# Altium project PowerBoard.PrjPcb (part 1 of 2)
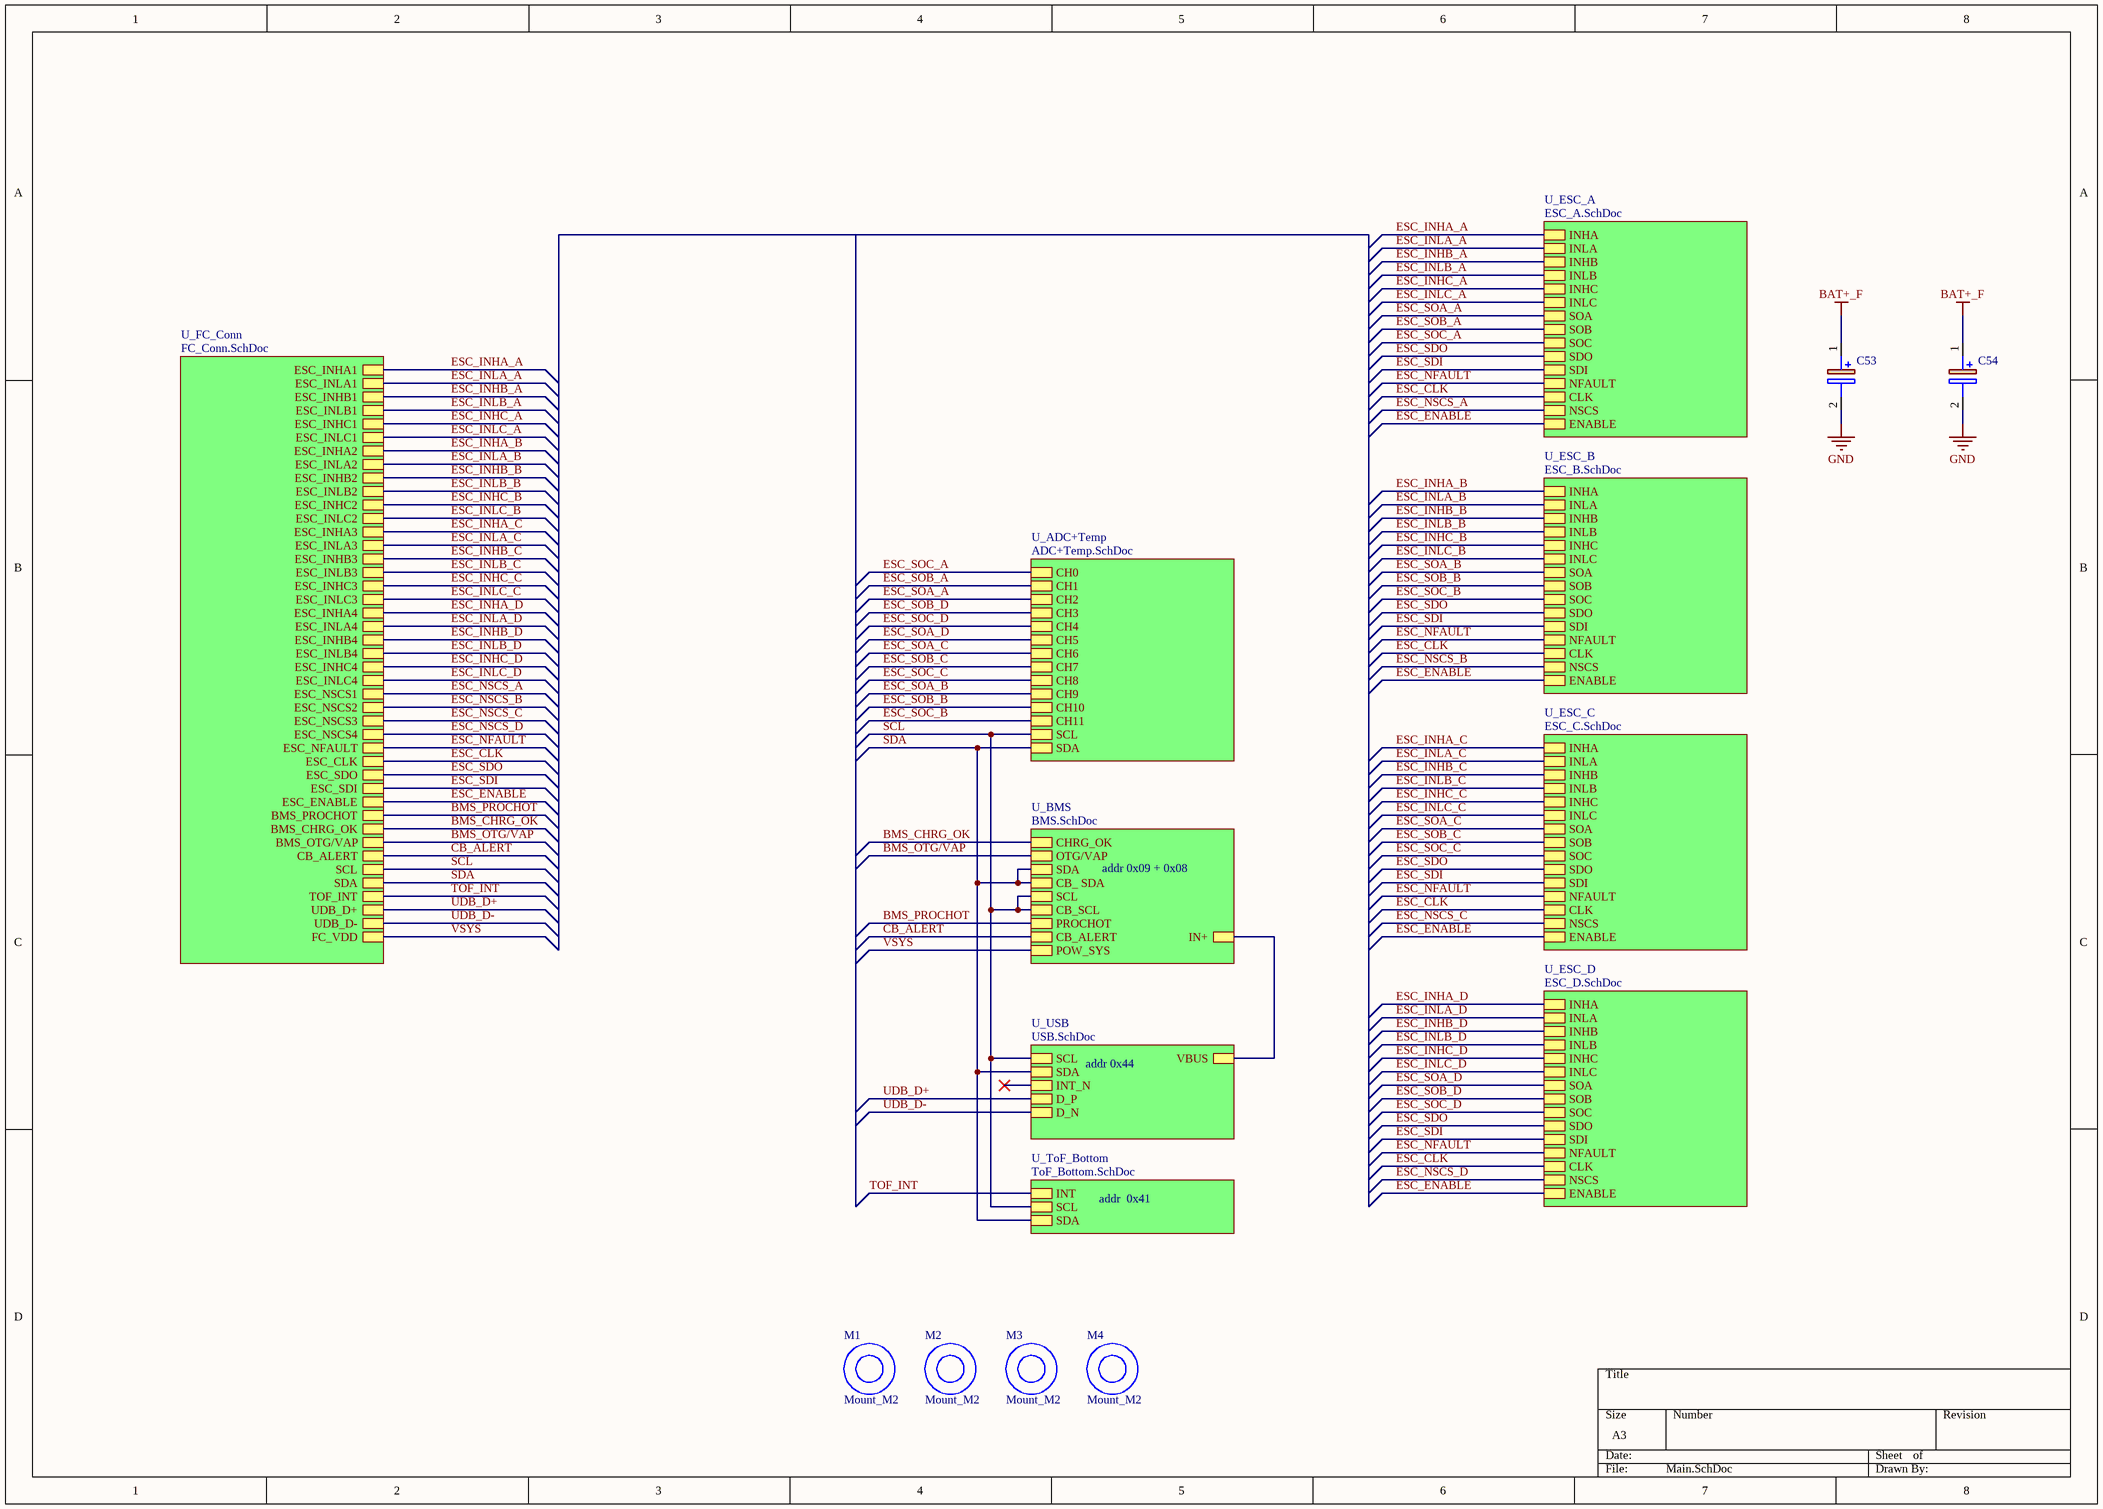
[diagram p0: Main.SchDoc]
10 sheets, 330 parts. Net scope: hierarchical (ports join the sheet entries above them; power ports are global).
Board file: PCB.PcbDoc
Sheets:
  Main.SchDoc
    U_BMS = BMS.SchDoc
    U_USB = USB.SchDoc
    U_ADC+Temp = ADC+Temp.SchDoc
    U_ToF_Bottom = ToF_Bottom.SchDoc
    U_FC_Conn = FC_Conn.SchDoc
    U_ESC_A = ESC_A.SchDoc
    U_ESC_B = ESC_B.SchDoc
    U_ESC_C = ESC_C.SchDoc
    U_ESC_D = ESC_D.SchDoc

## Sheet Main.SchDoc
size A3; SheetNumber: 1; SheetTotal: 10

### Parts
C53  EEH-ZL1V151XP  [EEEHP1H4R7P]  (value not drawn)
C54  EEH-ZL1V151XP  [EEEHP1H4R7P]  (value not drawn)
M1  Mount_M2  [Mount_M2]
M2  Mount_M2  [Mount_M2]
M3  Mount_M2  [Mount_M2]
M4  Mount_M2  [Mount_M2]

### Sub-sheets
U_ADC+Temp = ADC+Temp.SchDoc: SDA, SCL, CH0, CH1, CH2, CH3, CH4, CH5, CH6, CH7, CH8, CH9, CH10, CH11
U_BMS = BMS.SchDoc: CHRG_OK, OTG/VAP, SDA, SCL, PROCHOT, CB_SCL, CB_ SDA, CB_ALERT, POW_SYS, IN+
U_ESC_A = ESC_A.SchDoc: INHA, INLA, INHB, INLB, INHC, INLC, SOA, SOB, SOC, SDO, SDI, NFAULT, CLK, NSCS, ENABLE
U_ESC_B = ESC_B.SchDoc: INHA, INLA, INHB, INLB, INHC, INLC, SOA, SOB, SOC, SDO, SDI, NFAULT, CLK, NSCS, ENABLE
U_ESC_C = ESC_C.SchDoc: INHA, INLA, INHB, INLB, INHC, INLC, SOA, SOB, SOC, SDO, SDI, NFAULT, CLK, NSCS, ENABLE
U_ESC_D = ESC_D.SchDoc: INHA, INLA, INHB, INLB, INHC, INLC, SOA, SOB, SOC, SDO, SDI, NFAULT, CLK, NSCS, ENABLE
U_FC_Conn = FC_Conn.SchDoc: ESC_INLA1, ESC_INLB1, ESC_INLC1, ESC_INLA2, ESC_INLB2, ESC_INLC2, ESC_INLA3, ESC_INLB3, ESC_INLC3, ESC_INHA4, ESC_INLB4, ESC_INLC4, ESC_NSCS1, ESC_INHA1, ESC_INHB1, ESC_INHC1, ESC_INHA2, ESC_INHB2, ESC_INHC2, ESC_INHA3, ESC_INHB3, ESC_INHC3, ESC_INLA4, ESC_INHB4, ESC_INHC4, ESC_NSCS2, ESC_NSCS3, ESC_NSCS4, ESC_NFAULT, ESC_CLK, ESC_SDO, ESC_SDI, ESC_ENABLE, BMS_PROCHOT, BMS_CHRG_OK, BMS_OTG/VAP, CB_ALERT, SCL, SDA, TOF_INT, UDB_D+, UDB_D-, FC_VDD
U_ToF_Bottom = ToF_Bottom.SchDoc: INT, SCL, SDA
U_USB = USB.SchDoc: SCL, SDA, INT_N, D_P, D_N, VBUS

### Nets
BAT+_F: C53.1(+) C54.1(+)
GND: C53.2(-) C54.2(-)
BMS_CHRG_OK: sheet U_BMS/CHRG_OK, sheet U_FC_Conn/BMS_CHRG_OK
BMS_OTG/VAP: sheet U_BMS/OTG/VAP, sheet U_FC_Conn/BMS_OTG/VAP
BMS_PROCHOT: sheet U_BMS/PROCHOT, sheet U_FC_Conn/BMS_PROCHOT
CB_ALERT: sheet U_BMS/CB_ALERT, sheet U_FC_Conn/CB_ALERT
ESC_CLK: sheet U_FC_Conn/ESC_CLK, sheet U_ESC_A/CLK, sheet U_ESC_B/CLK, sheet U_ESC_C/CLK, sheet U_ESC_D/CLK
ESC_ENABLE: sheet U_FC_Conn/ESC_ENABLE, sheet U_ESC_A/ENABLE, sheet U_ESC_B/ENABLE, sheet U_ESC_C/ENABLE, sheet U_ESC_D/ENABLE
ESC_INHA_A: sheet U_FC_Conn/ESC_INHA1, sheet U_ESC_A/INHA
ESC_INHA_B: sheet U_FC_Conn/ESC_INHA2, sheet U_ESC_B/INHA
ESC_INHA_C: sheet U_FC_Conn/ESC_INHA3, sheet U_ESC_C/INHA
ESC_INHA_D: sheet U_FC_Conn/ESC_INHA4, sheet U_ESC_D/INHA
ESC_INHB_A: sheet U_FC_Conn/ESC_INHB1, sheet U_ESC_A/INHB
ESC_INHB_B: sheet U_FC_Conn/ESC_INHB2, sheet U_ESC_B/INHB
ESC_INHB_C: sheet U_FC_Conn/ESC_INHB3, sheet U_ESC_C/INHB
ESC_INHB_D: sheet U_FC_Conn/ESC_INHB4, sheet U_ESC_D/INHB
ESC_INHC_A: sheet U_FC_Conn/ESC_INHC1, sheet U_ESC_A/INHC
ESC_INHC_B: sheet U_FC_Conn/ESC_INHC2, sheet U_ESC_B/INHC
ESC_INHC_C: sheet U_FC_Conn/ESC_INHC3, sheet U_ESC_C/INHC
ESC_INHC_D: sheet U_FC_Conn/ESC_INHC4, sheet U_ESC_D/INHC
ESC_INLA_A: sheet U_FC_Conn/ESC_INLA1, sheet U_ESC_A/INLA
ESC_INLA_B: sheet U_FC_Conn/ESC_INLA2, sheet U_ESC_B/INLA
ESC_INLA_C: sheet U_FC_Conn/ESC_INLA3, sheet U_ESC_C/INLA
ESC_INLA_D: sheet U_FC_Conn/ESC_INLA4, sheet U_ESC_D/INLA
ESC_INLB_A: sheet U_FC_Conn/ESC_INLB1, sheet U_ESC_A/INLB
ESC_INLB_B: sheet U_FC_Conn/ESC_INLB2, sheet U_ESC_B/INLB
ESC_INLB_C: sheet U_FC_Conn/ESC_INLB3, sheet U_ESC_C/INLB
ESC_INLB_D: sheet U_FC_Conn/ESC_INLB4, sheet U_ESC_D/INLB
ESC_INLC_A: sheet U_FC_Conn/ESC_INLC1, sheet U_ESC_A/INLC
ESC_INLC_B: sheet U_FC_Conn/ESC_INLC2, sheet U_ESC_B/INLC
ESC_INLC_C: sheet U_FC_Conn/ESC_INLC3, sheet U_ESC_C/INLC
ESC_INLC_D: sheet U_FC_Conn/ESC_INLC4, sheet U_ESC_D/INLC
ESC_NFAULT: sheet U_FC_Conn/ESC_NFAULT, sheet U_ESC_A/NFAULT, sheet U_ESC_B/NFAULT, sheet U_ESC_C/NFAULT, sheet U_ESC_D/NFAULT
ESC_NSCS_A: sheet U_FC_Conn/ESC_NSCS1, sheet U_ESC_A/NSCS
ESC_NSCS_B: sheet U_FC_Conn/ESC_NSCS2, sheet U_ESC_B/NSCS
ESC_NSCS_C: sheet U_FC_Conn/ESC_NSCS3, sheet U_ESC_C/NSCS
ESC_NSCS_D: sheet U_FC_Conn/ESC_NSCS4, sheet U_ESC_D/NSCS
ESC_SDI: sheet U_FC_Conn/ESC_SDI, sheet U_ESC_A/SDI, sheet U_ESC_B/SDI, sheet U_ESC_C/SDI, sheet U_ESC_D/SDI
ESC_SDO: sheet U_FC_Conn/ESC_SDO, sheet U_ESC_A/SDO, sheet U_ESC_B/SDO, sheet U_ESC_C/SDO, sheet U_ESC_D/SDO
ESC_SOA_A: sheet U_ADC+Temp/CH2, sheet U_ESC_A/SOA
ESC_SOA_B: sheet U_ADC+Temp/CH9, sheet U_ESC_B/SOA
ESC_SOA_C: sheet U_ADC+Temp/CH6, sheet U_ESC_C/SOA
ESC_SOA_D: sheet U_ADC+Temp/CH5, sheet U_ESC_D/SOA
ESC_SOB_A: sheet U_ADC+Temp/CH1, sheet U_ESC_A/SOB
ESC_SOB_B: sheet U_ADC+Temp/CH10, sheet U_ESC_B/SOB
ESC_SOB_C: sheet U_ADC+Temp/CH7, sheet U_ESC_C/SOB
ESC_SOB_D: sheet U_ADC+Temp/CH3, sheet U_ESC_D/SOB
ESC_SOC_A: sheet U_ADC+Temp/CH0, sheet U_ESC_A/SOC
ESC_SOC_B: sheet U_ADC+Temp/CH11, sheet U_ESC_B/SOC
ESC_SOC_C: sheet U_ADC+Temp/CH8, sheet U_ESC_C/SOC
ESC_SOC_D: sheet U_ADC+Temp/CH4, sheet U_ESC_D/SOC
SCL: sheet U_BMS/SCL, sheet U_BMS/CB_SCL, sheet U_USB/SCL, sheet U_ADC+Temp/SCL, sheet U_ToF_Bottom/SCL, sheet U_FC_Conn/SCL
SDA: sheet U_BMS/SDA, sheet U_BMS/CB_ SDA, sheet U_USB/SDA, sheet U_ADC+Temp/SDA, sheet U_ToF_Bottom/SDA, sheet U_FC_Conn/SDA
TOF_INT: sheet U_ToF_Bottom/INT, sheet U_FC_Conn/TOF_INT
UDB_D+: sheet U_USB/D_P, sheet U_FC_Conn/UDB_D+  [project net D_P]
UDB_D-: sheet U_USB/D_N, sheet U_FC_Conn/UDB_D-  [project net D_N]
VBUS: sheet U_BMS/IN+, sheet U_USB/VBUS
VSYS: sheet U_BMS/POW_SYS, sheet U_FC_Conn/FC_VDD

### Notes on the sheet
- addr 0x09 + 0x08
- addr 0x44
- addr  0x41

### Library data of the parts
C53 C54 = EEH-ZL1V151XP: Capacitor Polarised; Manufacturer_Name: Panasonic; Datasheet Link: https://industrial.panasonic.com/cdbs/www-data/pdf/RDD0000/ast-ind-303928.pdf; Manufacturer_Part_Number: EEH-ZL1V151XP

## Sheet BMS.SchDoc
size A2; SheetNumber: 3; SheetTotal: 10
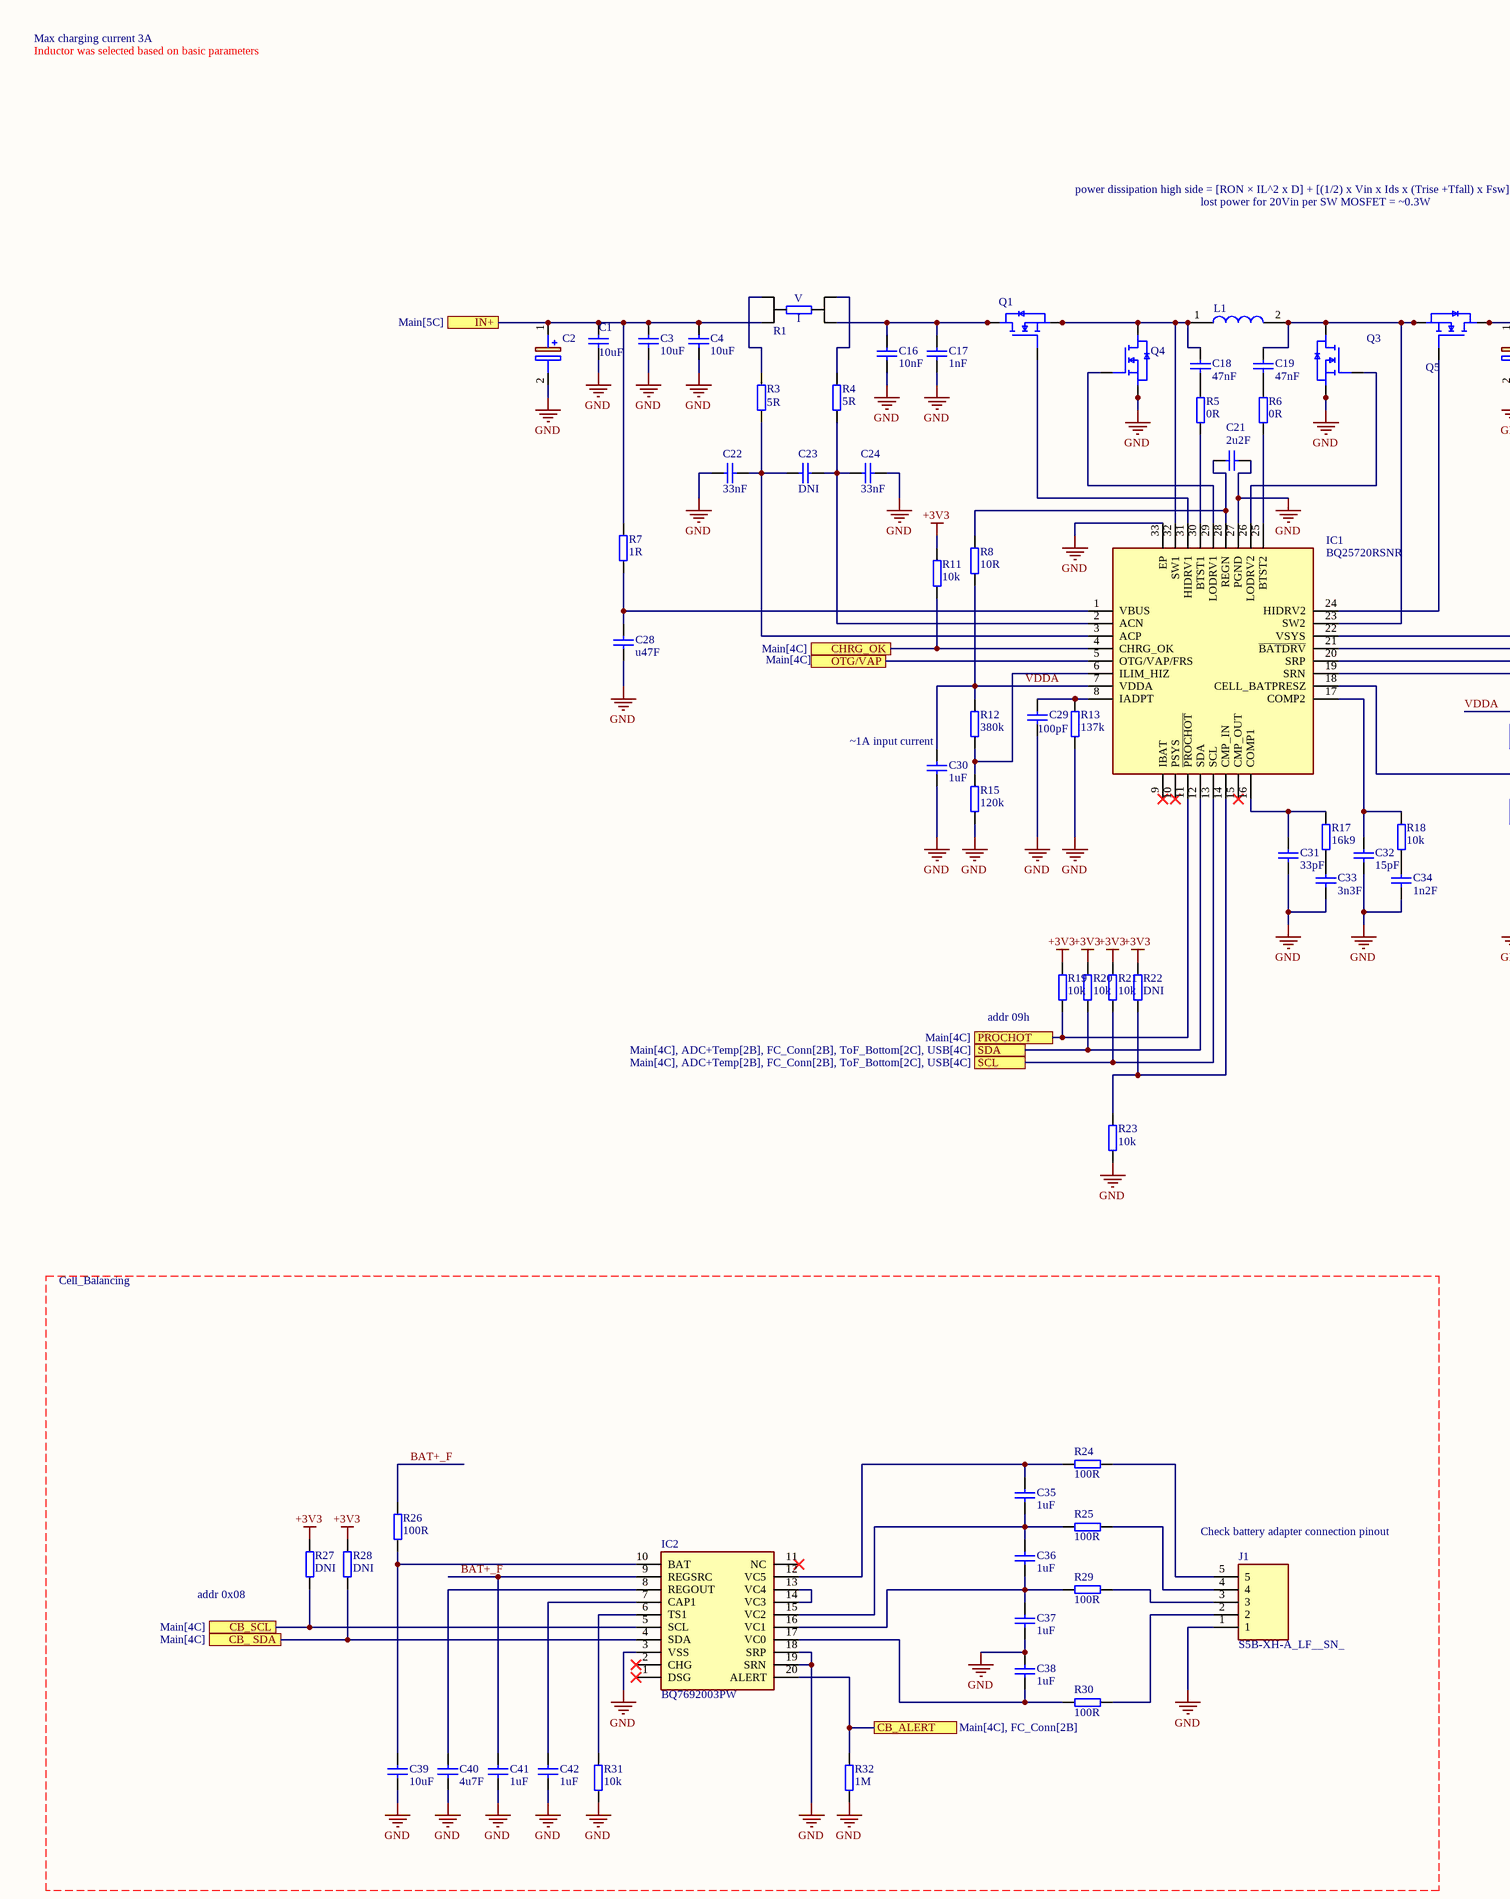
[diagram p1: BMS.SchDoc, left]
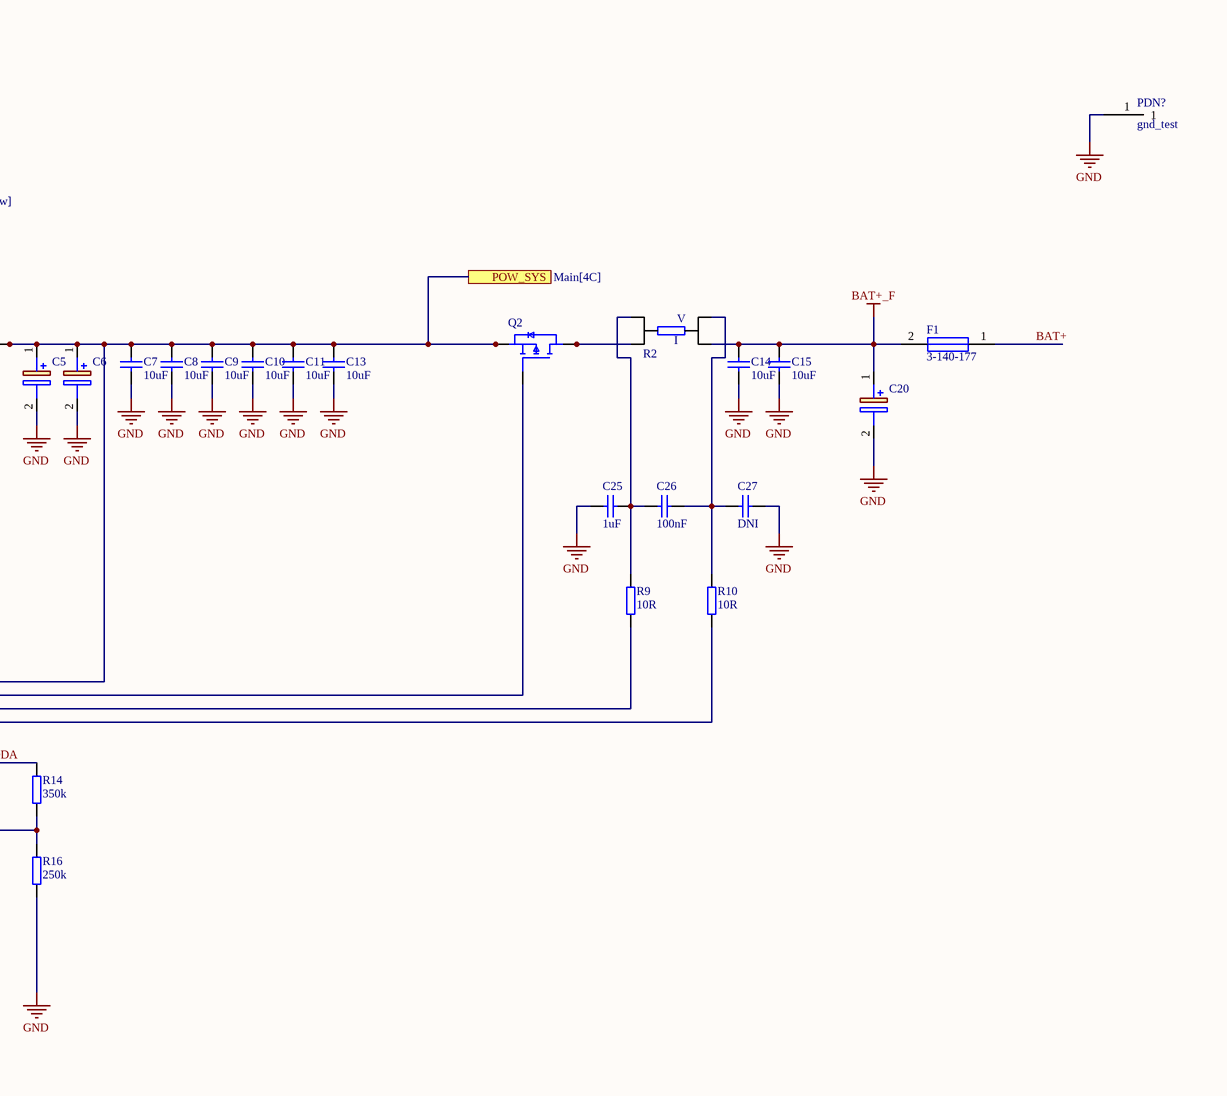
[diagram p2: BMS.SchDoc, right]

### Parts
C1  value 10uF  [CAP0603]  (hidden comment: Cap0603)
C2  TR3D336K025D0200  [CAPPM7343X310N]  (value not drawn)
C3  value 10uF  [CAP0805]  (hidden comment: Cap0805)
C4  value 10uF  [CAP0805]  (hidden comment: Cap0805)
C5  293D226X0025D2TE3  [CAPPM7343X310N]  (value not drawn)
C6  293D226X0025D2TE3  [CAPPM7343X310N]  (value not drawn)
C7  value 10uF  [CAP0805]  (hidden comment: Cap0805)
C8  value 10uF  [CAP0805]  (hidden comment: Cap0805)
C9  value 10uF  [CAP0805]  (hidden comment: Cap0805)
C10  value 10uF  [CAP0805]  (hidden comment: Cap0805)
C11  value 10uF  [CAP0805]  (hidden comment: Cap0805)
C13  value 10uF  [CAP0805]  (hidden comment: Cap0805)
C14  value 10uF  [CAP0805]  (hidden comment: Cap0805)
C15  value 10uF  [CAP0805]  (hidden comment: Cap0805)
C16  value 10nF  [CAP0402]  (hidden comment: Cap0402)
C17  value 1nF  [CAP0402]  (hidden comment: Cap0402)
C18  value 47nF  [CAP0402]  (hidden comment: Cap0402)
C19  value 47nF  [CAP0402]  (hidden comment: Cap0402)
C20  EEH-ZL1V151XP  [EEEHP1H4R7P]  (value not drawn)
C21  value 2u2F  [CAP0402]  (hidden comment: Cap0402)
C22  value 33nF  [CAP0402]  (hidden comment: Cap0402)
C23  value DNI  [CAP0402]  (hidden comment: Cap0402)
C24  value 33nF  [CAP0402]  (hidden comment: Cap0402)
C25  value 1uF  [CAP0402]  (hidden comment: Cap0402)
C26  value 100nF  [CAP0402]  (hidden comment: Cap0402)
C27  value DNI  [CAP0402]  (hidden comment: Cap0402)
C28  value u47F  [CAP0603]  (hidden comment: Cap0603)
C29  value 100pF  [CAP0402]  (hidden comment: Cap0402)
C30  value 1uF  [CAP0402]  (hidden comment: Cap0402)
C31  value 33pF  [CAP0402]  (hidden comment: Cap0402)
C32  value 15pF  [CAP0402]  (hidden comment: Cap0402)
C33  value 3n3F  [CAP0402]  (hidden comment: Cap0402)
C34  value 1n2F  [CAP0402]  (hidden comment: Cap0402)
C35  value 1uF  [CAP0402]  (hidden comment: Cap0402)
C36  value 1uF  [CAP0402]  (hidden comment: Cap0402)
C37  value 1uF  [CAP0402]  (hidden comment: Cap0402)
C38  value 1uF  [CAP0402]  (hidden comment: Cap0402)
C39  value 10uF  [CAP0805]  (hidden comment: Cap0805)
C40  value 4u7F  [CAP0805]  (hidden comment: Cap0402)
C41  value 1uF  [CAP0402]  (hidden comment: Cap0402)
C42  value 1uF  [CAP0402]  (hidden comment: Cap0402)
F1  3-140-177  [3140177]
IC1  BQ25720RSNR  [QFN40P400X400X80-33N-D]
IC2  BQ7692003PW  [SOP65P640X120-20N]
J1  S5B-XH-A_LF__SN_  [SHDRRA5W64P0X250_1X5_1490X1150X610P]
L1  XEL4020-222MEC  [XEL4020222MEC]  (value not drawn)
PDN?  gnd_test  [GND_test]
Q1  PMPB07R3ENAX  [DMT3006LFDF7]  (value not drawn)
Q2  SISA01DN-T1-GE3  [SIS862DNT1GE3]  (value not drawn)
Q3  PMPB07R3ENAX  [DMT3006LFDF7]  (value not drawn)
Q4  PMPB07R3ENAX  [DMT3006LFDF7]  (value not drawn)
Q5  PMPB07R3ENAX  [DMT3006LFDF7]  (value not drawn)
R1  L4CA0612LR010FNR  [L4CA0612L0M50FNR]  (value not drawn)
R2  L4CA0612LR010FNR  [L4CA0612L0M50FNR]  (value not drawn)
R3  value 5R  [RES0402]  (hidden comment: Res0402)
R4  value 5R  [RES0402]  (hidden comment: Res0402)
R5  value 0R  [RES0402]  (hidden comment: Res0402)
R6  value 0R  [RES0402]  (hidden comment: Res0402)
R7  value 1R  [RES0603]  (hidden comment: Res0603)
R8  value 10R  [RES0402]  (hidden comment: Res0402)
R9  value 10R  [RES0402]  (hidden comment: Res0402)
R10  value 10R  [RES0402]  (hidden comment: Res0402)
R11  value 10k  [RES0402]  (hidden comment: Res0402)
R12  value 380k  [RES0402]  (hidden comment: Res0402)
R13  value 137k  [RES0402]  (hidden comment: Res0402)
R14  value 350k  [RES0402]  (hidden comment: Res0402)
R15  value 120k  [RES0402]  (hidden comment: Res0402)
R16  value 250k  [RES0402]  (hidden comment: Res0402)
R17  value 16k9  [RES0402]  (hidden comment: Res0402)
R18  value 10k  [RES0402]  (hidden comment: Res0402)
R19  value 10k  [RES0402]  (hidden comment: Res0402)
R20  value 10k  [RES0402]  (hidden comment: Res0402)
R21  value 10k  [RES0402]  (hidden comment: Res0402)
R22  value DNI  [RES0402]  (hidden comment: Res0402)
R23  value 10k  [RES0402]  (hidden comment: Res0402)
R24  value 100R  [RES0805]  (hidden comment: Res0805)
R25  value 100R  [RES0805]  (hidden comment: Res0805)
R26  value 100R  [RES0402]  (hidden comment: Res0805)
R27  value DNI  [RES0402]  (hidden comment: Res0402)
R28  value DNI  [RES0402]  (hidden comment: Res0402)
R29  value 100R  [RES0805]  (hidden comment: Res0805)
R30  value 100R  [RES0805]  (hidden comment: Res0805)
R31  value 10k  [RES0402]  (hidden comment: Res0402)
R32  value 1M  [RES0402]  (hidden comment: Res0402)

### Ports
CB_ SDA (see Main[4C]), CB_ALERT (see Main[4C], FC_Conn[2B]), CB_SCL (see Main[4C]), CHRG_OK (see Main[4C]), IN+ (see Main[5C]), OTG/VAP (see Main[4C]), POW_SYS (see Main[4C]), PROCHOT (see Main[4C]), SCL (see Main[4C], ADC+Temp[2B], FC_Conn[2B], ToF_Bottom[2C], USB[4C]), SDA (see Main[4C], ADC+Temp[2B], FC_Conn[2B], ToF_Bottom[2C], USB[4C])

### Nets
+3V3: R11.2 R19.2 R20.2 R21.2 R22.2 R27.2 R28.2
BAT+_F: C14.2 C15.2 C20.1(+) C41.2 F1.2 IC2.9(REGSRC) R2.2 R26.2
GND: C1.1 C2.2(-) C3.1 C4.1 C5.2(-) C6.2(-) C7.1 C8.1 C9.1 C10.1 C11.1 C13.1 C14.1 C15.1 C16.1 C17.1 C20.2(-) C21.1 C22.1 C24.2 C25.1 C27.2 C28.1 C29.1 C30.1 C31.1 C32.1 C33.1 C34.1 C37.1 C38.2 C39.1 C40.1 C41.1 C42.1 IC1.27(PGND) IC1.33(EP) IC2.3(VSS) IC2.18(SRP) IC2.19(SRN) J1.1 PDN?.1 Q3.4(S_1) Q3.8(S_2) Q4.4(S_1) Q4.8(S_2) R13.1 R15.1 R16.1 R23.1 R31.1 R32.1
BAT+: F1.1
BMS_CHRG_OK: IC1.4(CHRG_OK) R11.1 ; port CHRG_OK
BMS_OTG/VAP: IC1.5(OTG/VAP/FRS) ; port OTG/VAP
BMS_PROCHOT: IC1.11(~{PROCHOT}) R19.1 ; port PROCHOT
CB_ALERT: IC2.20(ALERT) R32.2 ; port CB_ALERT
SCL: IC1.13(SCL) IC2.5(SCL) R21.1 R27.1 ; port SCL, port CB_SCL
SDA: IC1.12(SDA) IC2.4(SDA) R20.1 R28.1 ; port SDA, port CB_ SDA
VBUS: C1.2 C2.1(+) C3.2 C4.2 R1.2 R7.2 ; port IN+
VDDA: C30.2 IC1.7(VDDA) R8.2 R12.2 R14.2
VSYS: C5.1(+) C6.1(+) C7.2 C8.2 C9.2 C10.2 C11.2 C13.2 IC1.22(VSYS) Q2.1(S_1) Q2.2(S_2) Q2.3(S_3) Q5.1(D_1) Q5.2(D_2) Q5.5(D_3) Q5.6(D_4) Q5.7(D_5) ; port POW_SYS
NetC16_2: C16.2 C17.2 Q1.1(D_1) Q1.2(D_2) Q1.5(D_3) Q1.6(D_4) Q1.7(D_5) R1.3
NetC18_1: C18.1 R5.2
NetC18_2: C18.2 IC1.32(SW1) L1.1 Q1.4(S_1) Q1.8(S_2) Q4.1(D_1) Q4.2(D_2) Q4.5(D_3) Q4.6(D_4) Q4.7(D_5)
NetC19_1: C19.1 R6.2
NetC19_2: C19.2 IC1.23(SW2) L1.2 Q3.1(D_1) Q3.2(D_2) Q3.5(D_3) Q3.6(D_4) Q3.7(D_5) Q5.4(S_1) Q5.8(S_2)
NetC21_2: C21.2 IC1.28(REGN) R8.1
NetC22_2: C22.2 C23.1 IC1.3(ACP) R3.1
NetC23_2: C23.2 C24.1 IC1.2(ACN) R4.1
NetC25_2: C25.2 C26.1 R2.4 R9.2
NetC26_2: C26.2 C27.1 R2.1 R10.2
NetC28_2: C28.2 IC1.1(VBUS) R7.1
NetC29_2: C29.2 IC1.8(IADPT) R13.2
NetC31_2: C31.2 IC1.16(COMP1) R17.2
NetC32_2: C32.2 IC1.17(COMP2) R18.2
NetC33_2: C33.2 R17.1
NetC34_2: C34.2 R18.1
NetC35_1: C35.1 C36.2 IC2.15(VC2) R25.1
NetC35_2: C35.2 IC2.12(VC5) R24.1
NetC36_1: C36.1 C37.2 IC2.16(VC1) R29.1
NetC38_1: C38.1 IC2.17(VC0) R30.1
NetC39_2: C39.2 IC2.10(BAT) R26.1
NetC40_2: C40.2 IC2.8(REGOUT)
NetC42_2: C42.2 IC2.7(CAP1)
NetIC1_6: IC1.6(ILIM_HIZ) R12.1 R15.2
NetIC1_14: IC1.14(CMP_IN) R22.1 R23.2
NetIC1_18: IC1.18(CELL_BATPRESZ) R14.1 R16.2
NetIC1_19: IC1.19(SRN) R10.1
NetIC1_20: IC1.20(SRP) R9.1
NetIC1_21: IC1.21(~{BATDRV}) Q2.4(G)
NetIC1_24: IC1.24(HIDRV2) Q5.3(G)
NetIC1_25: IC1.25(BTST2) R6.1
NetIC1_26: IC1.26(LODRV2) Q3.3(G)
NetIC1_29: IC1.29(LODRV1) Q4.3(G)
NetIC1_30: IC1.30(BTST1) R5.1
NetIC1_31: IC1.31(HIDRV1) Q1.3(G)
NetIC2_6: IC2.6(TS1) R31.2
NetIC2_13: IC2.13(VC4) IC2.14(VC3)
NetJ1_2: J1.2 R30.2
NetJ1_3: J1.3 R29.2
NetJ1_4: J1.4 R25.2
NetJ1_5: J1.5 R24.2
NetQ2_5: Q2.5(D_1) Q2.6(D_2) Q2.7(D_3) Q2.8(D_4) Q2.9(D_4) R2.3
NetR1_1: R1.1 R3.2
NetR1_4: R1.4 R4.2

Not connected (* = marked no-connect by the designer): IC1 9(IBAT)* 10(PSYS)* 15(CMP_OUT)*; IC2 1(DSG)* 2(CHG)* 11(NC)*

### Notes on the sheet
- Max charging current 3A
- Inductor was selected based on basic parameters
- power dissipation high side = [RON × IL^2 x D] + [(1/2) x Vin x Ids x (Trise +Tfall) x Fsw]
- lost power for 20Vin per SW MOSFET = ~0.3W
- (near C30) ~1A input current
- (near R19) addr 09h
- Cell_Balancing
- (near J1) Check battery adapter connection pinout
- addr 0x08
- (in symbol L4CA0612LR010FNR) V; I

### Library data of the parts
C1 C28 = Cap0603: Voltage: 25V
C2 = TR3D336K025D0200: Capacitor Polarised; Manufacturer_Name: Vishay; Value: 33uF; Datasheet Link: http://www.vishay.com/doc?40080; Height: 3.1mm; Manufacturer_Part_Number: TR3D336K025D0200; Mouser Part Number: 74-TR3D336K025D0200; Mouser Price/Stock: https://www.mouser.com/Search/Refine.aspx?Keyword=74-TR3D336K025D0200
C3 C4 C7-C11 C13-C15 C39 = Cap0805: Voltage: 50V
C5 C6 = 293D226X0025D2TE3: Capacitor Polarised; Manufacturer_Name: Vishay; Value: 22uF; Datasheet Link: http://www.vishay.com/docs/40002/293d.pdf; Height: 3.1mm; Manufacturer_Part_Number: 293D226X0025D2TE3; Mouser Part Number: 74-293D226X0025D2TE3; Mouser Price/Stock: https://www.mouser.co.uk/ProductDetail/Vishay-Sprague/293D226X0025D2TE3?qs=27QRfRkF2isTHSjSebANCw%3D%3D
C16-C19 C40-C42 = Cap0402: Voltage: 50V
C20 = EEH-ZL1V151XP: as C53 on sheet Main; Datasheet Link: https://industrial.panasonic.com/cdbs/www-data/pdf/RDD0000/ast-ind-303928.pdf; Manufacturer_Part_Number: EEH-ZL1V151XP
C21 C29-C34 = Cap0402: Voltage: 25V
C22 C24-C26 C35-C38 = Cap0402: Voltage: 6V3
F1 = 3-140-177: Fuse; Manufacturer_Name: SCHURTER; Datasheet Link: https://www.schurter.com/en/datasheet/typ_UHS.pdf; Height: 4.85mm; Manufacturer_Part_Number: 3-140-177; Mouser Part Number: 693-3-140-177; Mouser Price/Stock: https://www.mouser.co.uk/ProductDetail/Schurter/3-140-177?qs=3Rah4i%252BhyCHL3c0yS6dOkg%3D%3D; Arrow Part Number: 3-140-177; Arrow Price/Stock: https://www.arrow.com/en/products/3-140-177/schurter?region=europe
IC1 = BQ25720RSNR: Integrated Circuit; Manufacturer_Name: Texas Instruments; Datasheet Link: https://www.ti.com/lit/ds/symlink/bq25720.pdf?ts=1649085131820&ref_url=https%253A%252F%252Fwww.ti.com%252Fproduct%252FBQ25720; Height: 0.8mm; Manufacturer_Part_Number: BQ25720RSNR; Mouser Part Number: 595-BQ25720RSNR; Mouser Price/Stock: https://www.mouser.co.uk/ProductDetail/Texas-Instruments/BQ25720RSNR?qs=ljCeji4nMDlwF8f%2Foae7aQ%3D%3D
IC2 = BQ7692003PW: Integrated Circuit; Manufacturer_Name: Texas Instruments; Datasheet Link: http://www.ti.com/lit/gpn/BQ76920; Height: 1.2mm; Manufacturer_Part_Number: BQ7692003PW; Mouser Part Number: 595-BQ7692003PW; Mouser Price/Stock: https://www.mouser.co.uk/ProductDetail/Texas-Instruments/BQ7692003PW?qs=%2Fd%252BFzHvH4c0Hx6X3GvdboA%3D%3D; Arrow Part Number: BQ7692003PW; Arrow Price/Stock: https://www.arrow.com/en/products/bq7692003pw/texas-instruments?utm_currency=USD&region=nac
J1 = S5B-XH-A_LF__SN_: Connector; Manufacturer_Name: JST (JAPAN SOLDERLESS TERMINALS); Manufacturer_Part_Number: S5B-XH-A(LF)(SN); Datasheet Link: http://www.jst-mfg.com/product/pdf/eng/eXH.pdf; Height: 6.1mm; Mouser Part Number: 306-S5B-XH-ALFSN; Mouser Price/Stock: https://www.mouser.co.uk/ProductDetail/JST-Commercial/S5B-XH-ALFSN?qs=QpmGXVUTftFJm7Okp%252B2lFg%3D%3D; Arrow Part Number: S5B-XH-A(LF)(SN); Arrow Price/Stock: https://www.arrow.com/en/products/s5b-xh-a-lf-sn/jst-manufacturing?utm_currency=USD&region=europe
L1 = XEL4020-222MEC: Inductor; Manufacturer_Name: COILCRAFT; Height: 2.1mm; Manufacturer_Part_Number: XEL4020-222MEC; Mouser Part Number: 994-XEL4020-222MEC; Mouser Price/Stock: https://www.mouser.co.uk/ProductDetail/Coilcraft/XEL4020-222MEC?qs=chTDxNqvsynf4rqMeCpizg%3D%3D
Q1 Q3-Q5 = DMT3006LFDF-7: MOSFET (N-Channel); Manufacturer_Name: Diodes Incorporated; Datasheet Link: https://www.arrow.com/en/products/dmt3006lfdf-7/diodes-incorporated; Height: 0.63mm; Manufacturer_Part_Number: DMT3006LFDF-7; Mouser Part Number: 621-DMT3006LFDF-7; Mouser Price/Stock: https://www.mouser.co.uk/ProductDetail/Diodes-Incorporated/DMT3006LFDF-7?qs=4EhzHfbM1GhGS5nn3gf3wg%3D%3D; Arrow Part Number: DMT3006LFDF-7; Arrow Price/Stock: https://www.arrow.com/en/products/dmt3006lfdf-7/diodes-incorporated
Q2 = SISA01DN-T1-GE3: MOSFET (P-Channel); Manufacturer_Name: Vishay; Datasheet Link: https://www.vishay.com/docs/76198/sisa01dn.pdf; Manufacturer_Part_Number: SISA01DN-T1-GE3; Mouser Part Number: 78-SISA01DN-T1-GE3; Mouser Price/Stock: https://www.mouser.co.uk/ProductDetail/Vishay-Semiconductors/SISA01DN-T1-GE3?qs=chTDxNqvsymq6IcOj9ze4g%3D%3D; Arrow Part Number: SISA01DN-T1-GE3; Arrow Price/Stock: https://www.arrow.com/en/products/sisa01dn-t1-ge3/vishay?region=nac
R1 R2 = L4CA0612LR010FNR: Resistor; Manufacturer_Name: LITTELFUSE; Datasheet Link: https://www.littelfuse.com/media?resourcetype=datasheets&itemid=db674d7b-aa25-4173-816a-92297475a59f&filename=littelfuse-resistor-l4ca-c-datasheet; Height: 0.7mm; Manufacturer_Part_Number: L4CA0612LR010FNR
C23 C27 = Cap0402: Voltage: DNI

## Sheet USB.SchDoc
size A4; SheetNumber: 4; SheetTotal: 10
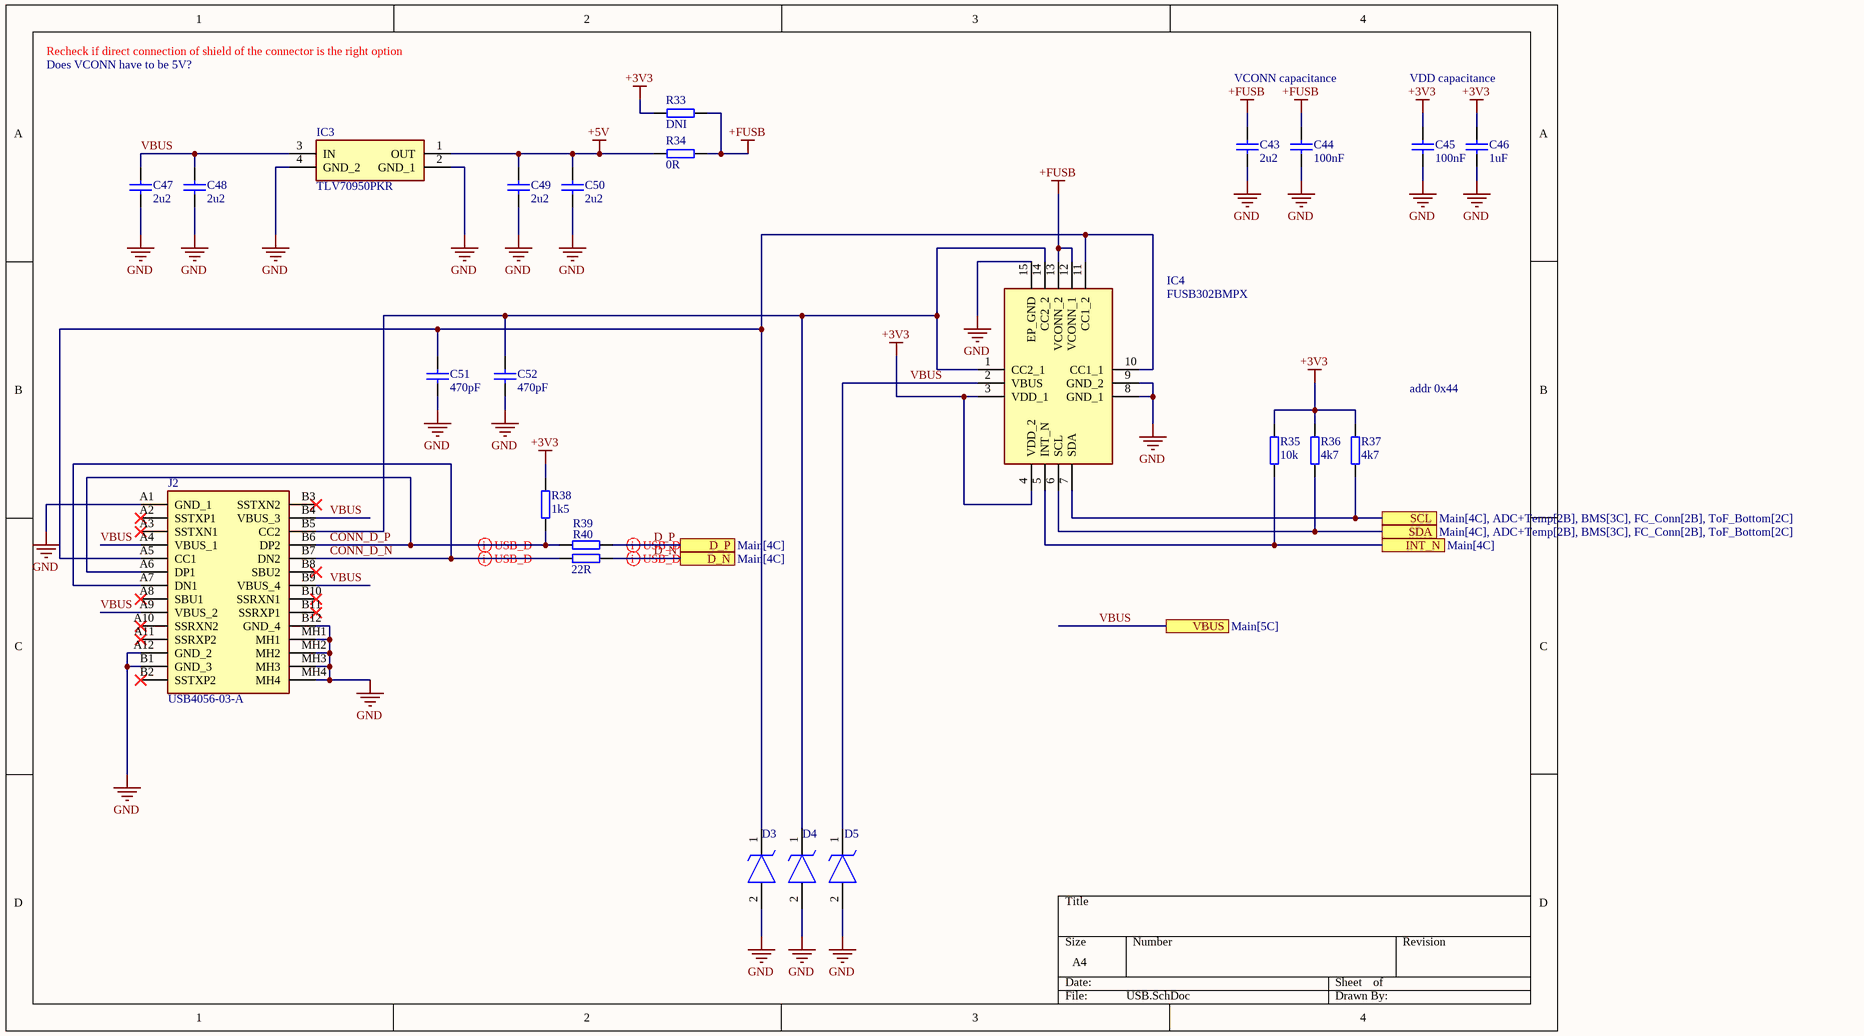
[diagram p3: USB.SchDoc]

### Parts
C43  value 2u2  [CAP0603]  (hidden comment: Cap0603)
C44  value 100nF  [CAP0402]  (hidden comment: Cap0402)
C45  value 100nF  [CAP0402]  (hidden comment: Cap0402)
C46  value 1uF  [CAP0402]  (hidden comment: Cap0402)
C47  value 2u2  [CAP0603]  (hidden comment: Cap0603)
C48  value 2u2  [CAP0603]  (hidden comment: Cap0603)
C49  value 2u2  [CAP0603]  (hidden comment: Cap0603)
C50  value 2u2  [CAP0603]  (hidden comment: Cap0603)
C51  value 470pF  [CAP0402]  (hidden comment: Cap0402)
C52  value 470pF  [CAP0402]  (hidden comment: Cap0402)
D3  D1213A-01LP4-7B  [D1213A01LP47B]  (value not drawn)
D4  D1213A-01LP4-7B  [D1213A01LP47B]  (value not drawn)
D5  DF2S24FS,L3M  [SODFL1006X45N]  (value not drawn)
IC3  TLV70950PKR  [TL431AQPKG3]
IC4  FUSB302BMPX  [QFN50P250X250X80-15N]
J2  USB4056-03-A  [USB405603A]
R33  value DNI  [RES0402]  (hidden comment: Res0402)
R34  value 0R  [RES0402]  (hidden comment: Res0402)
R35  value 10k  [RES0402]  (hidden comment: Res0402)
R36  value 4k7  [RES0402]  (hidden comment: Res0402)
R37  value 4k7  [RES0402]  (hidden comment: Res0402)
R38  value 1k5  [RES0402]  (hidden comment: Res0402)
R39  Res0402  [RES0402]  (value not drawn)
R40  value 22R  [RES0402]  (hidden comment: Res0402)

### Ports
D_N (see Main[4C]), D_P (see Main[4C]), INT_N (see Main[4C]), SCL (see Main[4C], ADC+Temp[2B], BMS[3C], FC_Conn[2B], ToF_Bottom[2C]), SDA (see Main[4C], ADC+Temp[2B], BMS[3C], FC_Conn[2B], ToF_Bottom[2C]), VBUS (see Main[5C])

### Nets
+3V3: C45.2 C46.2 IC4.3(VDD_1) IC4.4(VDD_2) R33.2 R35.2 R36.2 R37.2 R38.2
+5V: C49.2 C50.2 IC3.1(OUT) R34.2
+FUSB: C43.2 C44.2 IC4.12(VCONN_1) IC4.13(VCONN_2) R33.1 R34.1
GND: C43.1 C44.1 C45.1 C46.1 C47.1 C48.1 C49.1 C50.1 C51.1 C52.1 D3.2(A) D4.2(A) D5.2(A) IC3.2(GND_1) IC3.4(GND_2) IC4.8(GND_1) IC4.9(GND_2) IC4.15(EP_GND) J2.A1(GND_1) J2.A12(GND_2) J2.B1(GND_3) J2.B12(GND_4) J2.MH1 J2.MH2 J2.MH3 J2.MH4
CONN_D_N: J2.A7(DN1) J2.B7(DN2) R40.1
CONN_D_P: J2.A6(DP1) J2.B6(DP2) R38.1 R39.1
D_N: R40.2 ; port D_N
D_P: R39.2 ; port D_P
SCL: IC4.7(SDA) R37.1 ; port SCL
SDA: IC4.6(SCL) R36.1 ; port SDA
VBUS: C47.2 C48.2 D5.1(K) IC3.3(IN) IC4.2(VBUS) J2.A4(VBUS_1) J2.A9(VBUS_2) J2.B4(VBUS_3) J2.B9(VBUS_4) ; port VBUS
NetC51_2: C51.2 D3.1(K) IC4.10(CC1_1) IC4.11(CC1_2) J2.A5(CC1)
NetC52_2: C52.2 D4.1(K) IC4.1(CC2_1) IC4.14(CC2_2) J2.B5(CC2)
NetIC4_5: IC4.5(INT_N) R35.1 ; port INT_N

Not connected (* = marked no-connect by the designer): J2 A2(SSTXP1)* A3(SSTXN1)* A8(SBU1)* A10(SSRXN2)* A11(SSRXP2)* B2(SSTXP2)* B3(SSTXN2)* B8(SBU2)* B10(SSRXN1)* B11(SSRXP1)*

### Layout directives
differential pair: CONN_D_N, CONN_D_P, D_N, D_P

### Notes on the sheet
- Recheck if direct connection of shield of the connector is the right option
- Does VCONN have to be 5V?
- VCONN capacitance
- VDD capacitance
- addr 0x44

### Library data of the parts
C43 C47-C50 = Cap0603: Voltage: 50V
C44-C46 = Cap0402: Voltage: 6V3
C51 C52 = Cap0402: Voltage: val
D3 D4 = D1213A-01LP4-7B: TVS Diode (Uni-directional); Manufacturer_Name: Diodes Incorporated; Datasheet Link: https://www.diodes.com/assets/Datasheets/D1213A-01LP4.pdf; Height: 0.4mm; Manufacturer_Part_Number: D1213A-01LP4-7B; Mouser Part Number: 621-D1213A-01LP4-7B; Mouser Price/Stock: https://www.mouser.co.uk/ProductDetail/Diodes-Incorporated/D1213A-01LP4-7B?qs=gfe7vQ8txpVKfG5NOSOvfA%3D%3D; Arrow Part Number: D1213A-01LP4-7B; Arrow Price/Stock: https://www.arrow.com/en/products/d1213a-01lp4-7b/diodes-incorporated?region=europe
D5 = DF2S24FS,L3M: TVS Diode (Uni-directional); Manufacturer_Name: Toshiba; Datasheet Link: https://www.mouser.com/datasheet/2/408/DF2S24FS_datasheet_en_20140718-708374.pdf; Height: 0.45mm; Manufacturer_Part_Number: DF2S24FS,L3M; Mouser Part Number: 757-DF2S24FSL3M; Mouser Price/Stock: https://www.mouser.co.uk/ProductDetail/Toshiba/DF2S24FSL3M?qs=lhkzy8lC%252BSvG2umxl0FuEw%3D%3D; Arrow Part Number: DF2S24FS,L3M; Arrow Price/Stock: https://www.arrow.com/en/products/df2s24fsl3m/toshiba?region=nac
IC3 = TLV70950PKR: Integrated Circuit; Manufacturer_Name: Texas Instruments; Datasheet Link: https://www.ti.com/lit/gpn/tlv709; Height: 1.6mm; Manufacturer_Part_Number: TLV70950PKR; Mouser Part Number: 595-TLV70950PKR; Mouser Price/Stock: https://www.mouser.co.uk/ProductDetail/Texas-Instruments/TLV70950PKR?qs=dbcCsuKDzFU3yYGsVf2izQ%3D%3D; Arrow Part Number: TLV70950PKR; Arrow Price/Stock: null?region=nac
IC4 = FUSB302BMPX: Integrated Circuit; Manufacturer_Name: onsemi; Datasheet Link: https://www.onsemi.com/pub/Collateral/FUSB302B-D.PDF; Height: 0.8mm; Manufacturer_Part_Number: FUSB302BMPX; Mouser Part Number: 512-FUSB302BMPX; Mouser Price/Stock: https://www.mouser.co.uk/ProductDetail/onsemi-Fairchild/FUSB302BMPX?qs=8ziscO3x5y1SHqdwooDK6g%3D%3D; Arrow Part Number: FUSB302BMPX; Arrow Price/Stock: https://www.arrow.com/en/products/fusb302bmpx/on-semiconductor?utm_currency=USD&region=nac
J2 = USB4056-03-A: Connector; Manufacturer_Name: GCT (GLOBAL CONNECTOR TECHNOLOGY); Datasheet Link: https://www.mouser.jp/datasheet/2/837/usb4056-2448808.pdf; Height: 3.56mm; Manufacturer_Part_Number: USB4056-03-A; Mouser Part Number: 640-USB4056-03-A; Mouser Price/Stock: https://www.mouser.co.uk/ProductDetail/GCT/USB4056-03-A?qs=QNEnbhJQKvbZ7hZzgFEugA%3D%3D
R39 = Res0402: Value: 22R

## Sheet ADC+Temp.SchDoc
size A3; SheetNumber: 5; SheetTotal: 10
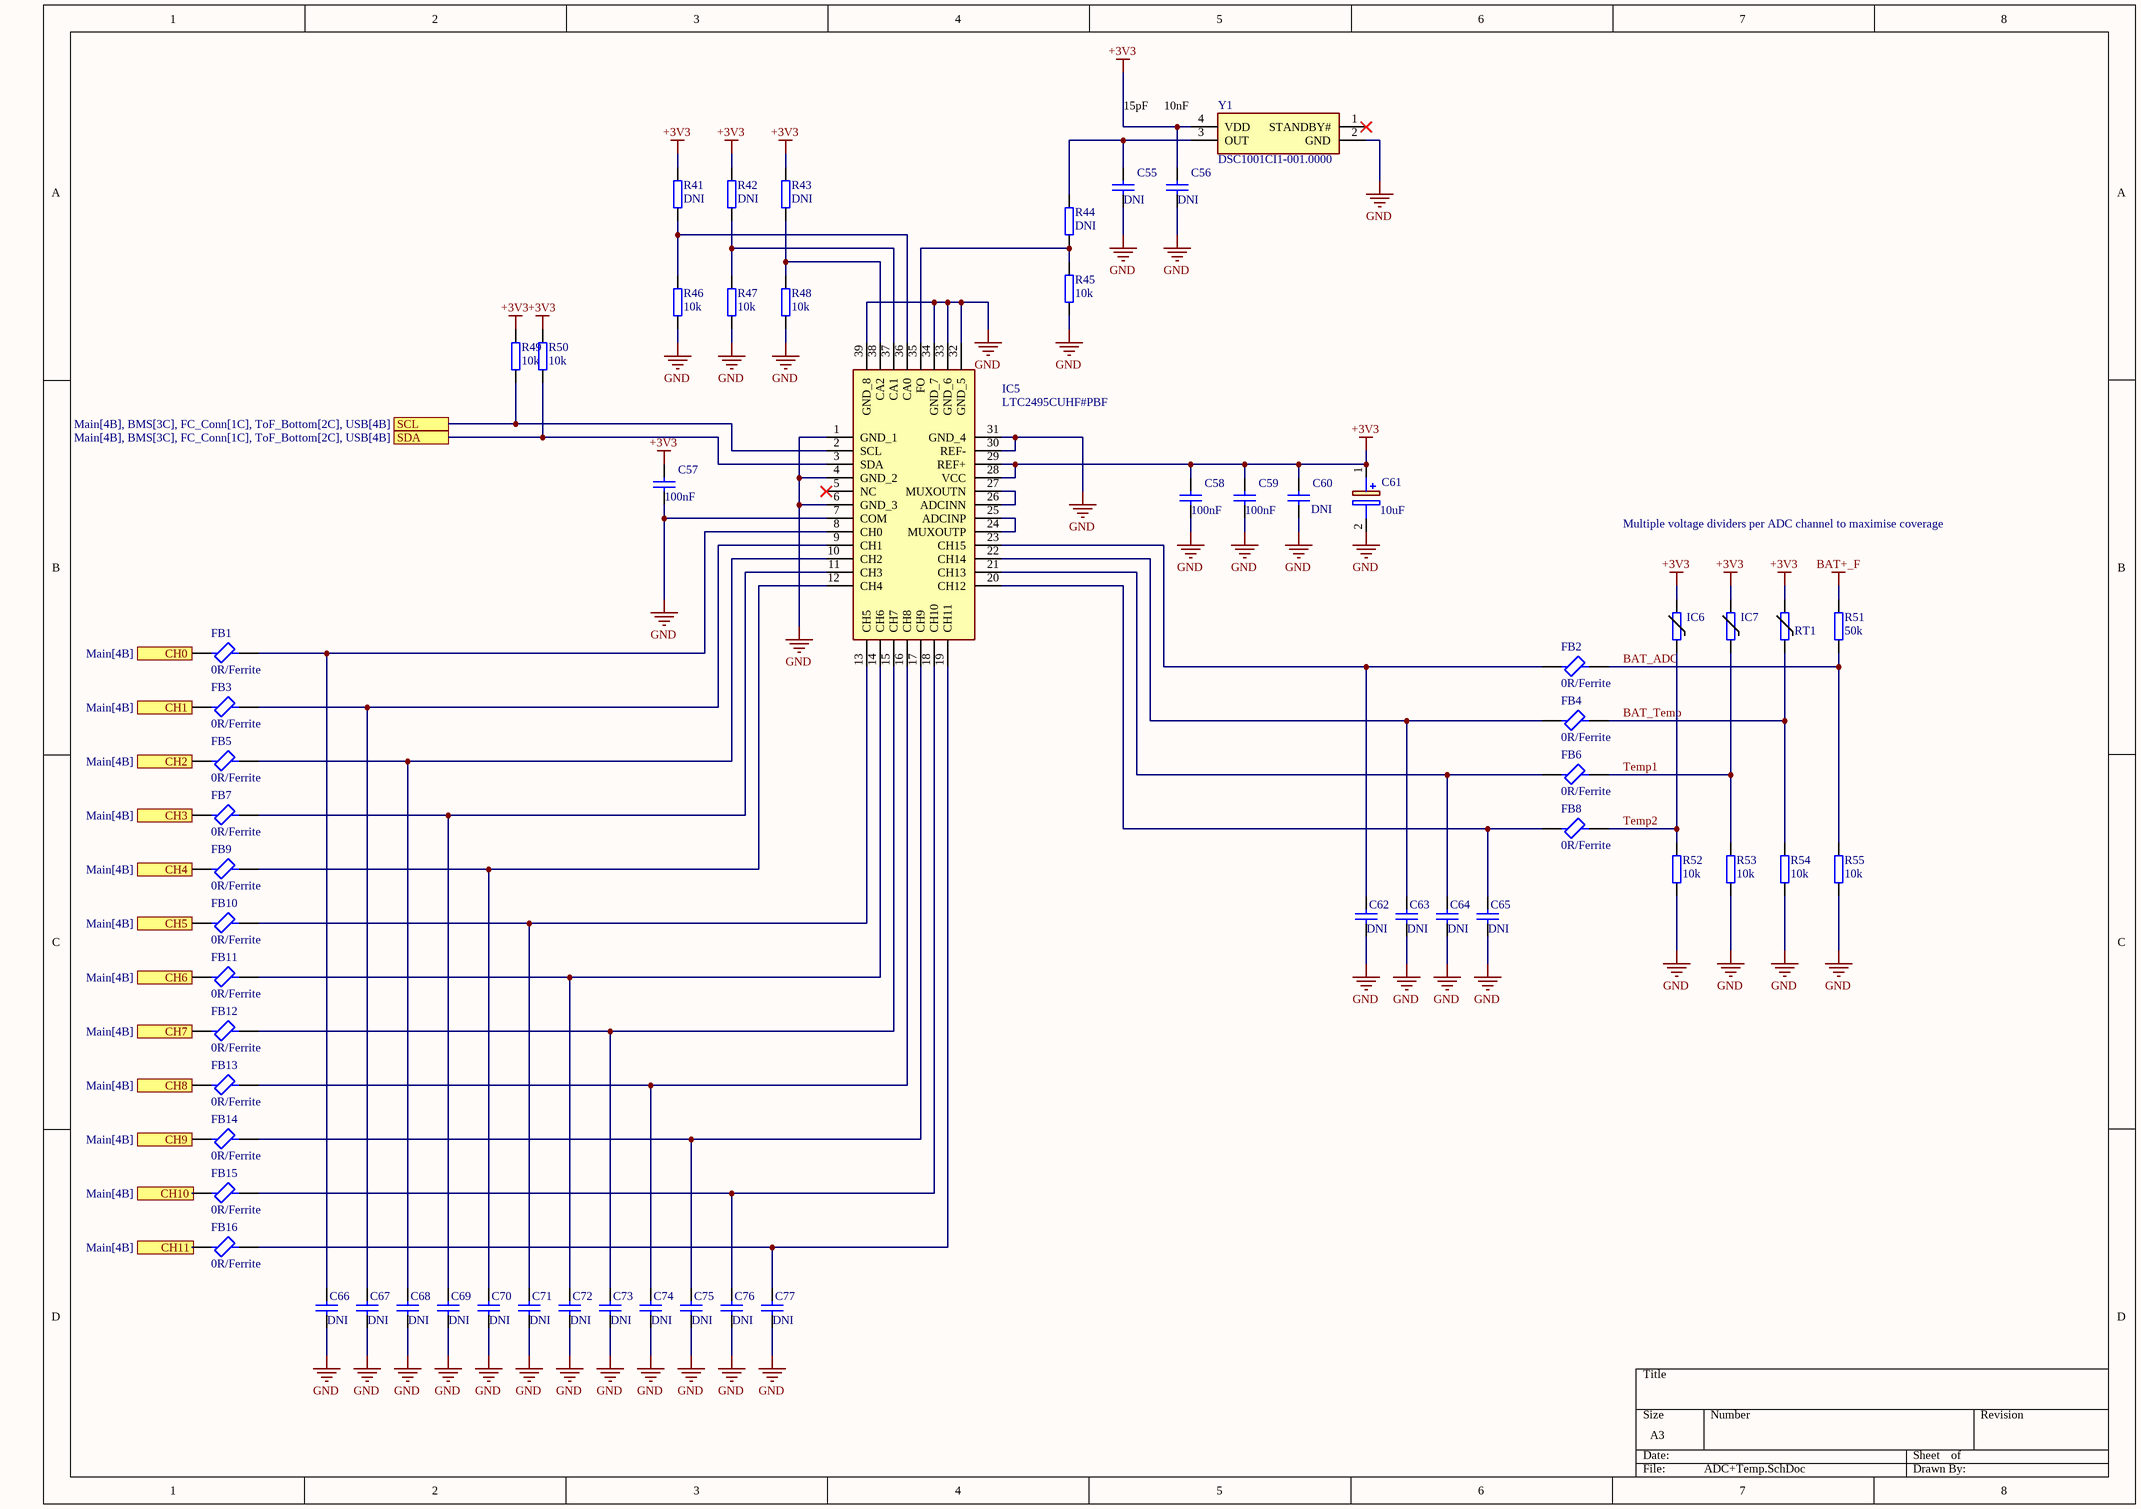
[diagram p4: ADC+Temp.SchDoc]

### Parts
C55  value DNI  [CAP0402]  (hidden comment: Cap0402)
C56  value DNI  [CAP0402]  (hidden comment: Cap0402)
C57  value 100nF  [CAP0402]  (hidden comment: Cap0402)
C58  value 100nF  [CAP0402]  (hidden comment: Cap0402)
C59  value 100nF  [CAP0402]  (hidden comment: Cap0402)
C60  value DNI  [CAP0603]  (hidden comment: Cap0603)
C61  value 10uF  [CAPPC1608X90N]  (hidden comment: TMCJ0J106MTRF)
C62  value DNI  [CAP0402]  (hidden comment: Cap0402)
C63  value DNI  [CAP0402]  (hidden comment: Cap0402)
C64  value DNI  [CAP0402]  (hidden comment: Cap0402)
C65  value DNI  [CAP0402]  (hidden comment: Cap0402)
C66  value DNI  [CAP0402]  (hidden comment: Cap0402)
C67  value DNI  [CAP0402]  (hidden comment: Cap0402)
C68  value DNI  [CAP0402]  (hidden comment: Cap0402)
C69  value DNI  [CAP0402]  (hidden comment: Cap0402)
C70  value DNI  [CAP0402]  (hidden comment: Cap0402)
C71  value DNI  [CAP0402]  (hidden comment: Cap0402)
C72  value DNI  [CAP0402]  (hidden comment: Cap0402)
C73  value DNI  [CAP0402]  (hidden comment: Cap0402)
C74  value DNI  [CAP0402]  (hidden comment: Cap0402)
C75  value DNI  [CAP0402]  (hidden comment: Cap0402)
C76  value DNI  [CAP0402]  (hidden comment: Cap0402)
C77  value DNI  [CAP0402]  (hidden comment: Cap0402)
FB1  0R/Ferrite  [NFZ15SG152SN10B]
FB2  0R/Ferrite  [NFZ15SG152SN10B]
FB3  0R/Ferrite  [NFZ15SG152SN10B]
FB4  0R/Ferrite  [NFZ15SG152SN10B]
FB5  0R/Ferrite  [NFZ15SG152SN10B]
FB6  0R/Ferrite  [NFZ15SG152SN10B]
FB7  0R/Ferrite  [NFZ15SG152SN10B]
FB8  0R/Ferrite  [NFZ15SG152SN10B]
FB9  0R/Ferrite  [NFZ15SG152SN10B]
FB10  0R/Ferrite  [NFZ15SG152SN10B]
FB11  0R/Ferrite  [NFZ15SG152SN10B]
FB12  0R/Ferrite  [NFZ15SG152SN10B]
FB13  0R/Ferrite  [NFZ15SG152SN10B]
FB14  0R/Ferrite  [NFZ15SG152SN10B]
FB15  0R/Ferrite  [NFZ15SG152SN10B]
FB16  0R/Ferrite  [NFZ15SG152SN10B]
IC5  LTC2495CUHF#PBF  [QFN50P500X700X80-39N-D]
IC6  TMP6131DECR  [TMP6131DECR]  (value not drawn)
IC7  TMP6131DECR  [TMP6131DECR]  (value not drawn)
R41  value DNI  [RES0402]  (hidden comment: Res0402)
R42  value DNI  [RES0402]  (hidden comment: Res0402)
R43  value DNI  [RES0402]  (hidden comment: Res0402)
R44  value DNI  [RES0402]  (hidden comment: Res0402)
R45  value 10k  [RES0402]  (hidden comment: Res0402)
R46  value 10k  [RES0402]  (hidden comment: Res0402)
R47  value 10k  [RES0402]  (hidden comment: Res0402)
R48  value 10k  [RES0402]  (hidden comment: Res0402)
R49  value 10k  [RES0402]  (hidden comment: Res0402)
R50  value 10k  [RES0402]  (hidden comment: Res0402)
R51  value 50k  [RES0402]  (hidden comment: Res0402)
R52  value 10k  [RES0402]  (hidden comment: Res0402)
R53  value 10k  [RES0402]  (hidden comment: Res0402)
R54  value 10k  [RES0402]  (hidden comment: Res0402)
R55  value 10k  [RES0402]  (hidden comment: Res0402)
RT1  B57862L0103F000/B59100M1080A070  [B57862L0102F000]  (value not drawn)
Y1  DSC1001CI1-001.0000  [DSC1001CI10010000]

### Ports
CH0 (see Main[4B]), CH1 (see Main[4B]), CH2 (see Main[4B]), CH3 (see Main[4B]), CH4 (see Main[4B]), CH5 (see Main[4B]), CH6 (see Main[4B]), CH7 (see Main[4B]), CH8 (see Main[4B]), CH9 (see Main[4B]), CH10 (see Main[4B]), CH11 (see Main[4B]), SCL (see Main[4B], BMS[3C], FC_Conn[1C], ToF_Bottom[2C], USB[4B]), SDA (see Main[4B], BMS[3C], FC_Conn[1C], ToF_Bottom[2C], USB[4B])

### Nets
+3V3: C56.2 C57.2 C58.2 C59.2 C60.2 C61.1(+) IC5.28(VCC) IC5.29(REF+) IC6.2 IC7.2 R41.2 R42.2 R43.2 R49.2 R50.2 RT1.2 Y1.4(VDD)
BAT+_F: R51.2
GND: C55.1 C56.1 C57.1 C58.1 C59.1 C60.1 C61.2(-) C62.1 C63.1 C64.1 C65.1 C66.1 C67.1 C68.1 C69.1 C70.1 C71.1 C72.1 C73.1 C74.1 C75.1 C76.1 C77.1 IC5.1(GND_1) IC5.4(GND_2) IC5.6(GND_3) IC5.7(COM) IC5.30(REF-) IC5.31(GND_4) IC5.32(GND_5) IC5.33(GND_6) IC5.34(GND_7) IC5.39(GND_8) R45.1 R46.1 R47.1 R48.1 R52.1 R53.1 R54.1 R55.1 Y1.2(GND)
BAT_ADC: FB2.2 R51.1 R55.2
BAT_Temp: FB4.2 R54.2 RT1.1
ESC_SOA_A: FB5.1 ; port CH2
ESC_SOA_B: FB14.1 ; port CH9
ESC_SOA_C: FB11.1 ; port CH6
ESC_SOA_D: FB10.1 ; port CH5
ESC_SOB_A: FB3.1 ; port CH1
ESC_SOB_B: FB15.1 ; port CH10
ESC_SOB_C: FB12.1 ; port CH7
ESC_SOB_D: FB7.1 ; port CH3
ESC_SOC_A: FB1.1 ; port CH0
ESC_SOC_B: FB16.1 ; port CH11
ESC_SOC_C: FB13.1 ; port CH8
ESC_SOC_D: FB9.1 ; port CH4
SCL: IC5.2(SCL) R49.1 ; port SCL
SDA: IC5.3(SDA) R50.1 ; port SDA
Temp1: FB6.2 IC7.1 R53.2
Temp2: FB8.2 IC6.1 R52.2
NetC55_2: C55.2 R44.2 Y1.3(OUT)
NetC62_2: C62.2 FB2.1 IC5.23(CH15)
NetC63_2: C63.2 FB4.1 IC5.22(CH14)
NetC64_2: C64.2 FB6.1 IC5.21(CH13)
NetC65_2: C65.2 FB8.1 IC5.20(CH12)
NetC66_2: C66.2 FB1.2 IC5.8(CH0)
NetC67_2: C67.2 FB3.2 IC5.9(CH1)
NetC68_2: C68.2 FB5.2 IC5.10(CH2)
NetC69_2: C69.2 FB7.2 IC5.11(CH3)
NetC70_2: C70.2 FB9.2 IC5.12(CH4)
NetC71_2: C71.2 FB10.2 IC5.13(CH5)
NetC72_2: C72.2 FB11.2 IC5.14(CH6)
NetC73_2: C73.2 FB12.2 IC5.15(CH7)
NetC74_2: C74.2 FB13.2 IC5.16(CH8)
NetC75_2: C75.2 FB14.2 IC5.17(CH9)
NetC76_2: C76.2 FB15.2 IC5.18(CH10)
NetC77_2: C77.2 FB16.2 IC5.19(CH11)
NetIC5_24: IC5.24(MUXOUTP) IC5.25(ADCINP)
NetIC5_26: IC5.26(ADCINN) IC5.27(MUXOUTN)
NetIC5_35: IC5.35(FO) R44.1 R45.2
NetIC5_36: IC5.36(CA0) R41.1 R46.2
NetIC5_37: IC5.37(CA1) R42.1 R47.2
NetIC5_38: IC5.38(CA2) R43.1 R48.2

Not connected (* = marked no-connect by the designer): IC5 5(NC)*; Y1 1(STANDBY#)*

### Notes on the sheet
- 15pF
- (near Y1) 10nF
- Multiple voltage dividers per ADC channel to maximise coverage

### Library data of the parts
C55 C56 = Cap0402: DNI; Voltage: DNI
C57-C59 = Cap0402: Voltage: 50V
C61 = 298D106X96R3M2T: Capacitor Polarised; Voltage: 6V3
FB1-FB16 = BLM15PE471SH1D: Ferrite Bead; Manufacturer_Name: Murata Electronics; Datasheet Link: https://www.murata.com/en-global/products/productdetail.aspx?cate=luNoiseSupprFilteChipFerriBead&partno=BLM15PE471SH1%23; Height: 0.55mm; Manufacturer_Part_Number: BLM15PE471SH1D; Mouser Part Number: 81-BLM15PE471SH1D; Mouser Price/Stock: https://www.mouser.co.uk/ProductDetail/Murata-Electronics/BLM15PE471SH1D?qs=DRkmTr78QATAY5qAVx1hGA%3D%3D
IC5 = LTC2495CUHF#PBF: Integrated Circuit; Manufacturer_Name: Analog Devices; Datasheet Link: https://www.analog.com/media/en/technical-documentation/data-sheets/2495fe.pdf; Height: 0.8mm; Manufacturer_Part_Number: LTC2495CUHF#PBF; Mouser Part Number: 584-LTC2495CUHF#PBF; Mouser Price/Stock: https://www.mouser.co.uk/ProductDetail/Analog-Devices/LTC2495CUHFPBF?qs=hVkxg5c3xu%252Bd9nHQ1gaMcw%3D%3D; Arrow Part Number: LTC2495CUHF#PBF; Arrow Price/Stock: https://www.arrow.com/en/products/ltc2495cuhfpbf/analog-devices?region=europe
IC6 IC7 = TMP6131DECR: Integrated Circuit; Manufacturer_Name: Texas Instruments; Datasheet Link: http://www.ti.com/lit/gpn/TMP61; Height: 0.5mm; Manufacturer_Part_Number: TMP6131DECR; Mouser Part Number: 595-TMP6131DECR; Mouser Price/Stock: https://www.mouser.co.uk/ProductDetail/Texas-Instruments/TMP6131DECR?qs=l7cgNqFNU1jnXQehRCOLwA%3D%3D; Arrow Part Number: TMP6131DECR; Arrow Price/Stock: https://www.arrow.com/en/products/tmp6131decr/texas-instruments?region=nac
RT1 = B57862L0103F000: Thermistor; Manufacturer_Name: TDK; Datasheet Link: https://product.tdk.com/system/files/dam/doc/product/sensor/ntc/ntc_element/data_sheet/50/db/ntc/ntc_mini_sensors_l862.pdf; Height: 6.5mm; Manufacturer_Part_Number: B57862L0103F000; Mouser Part Number: 871-B57862L0103F000; Mouser Price/Stock: https://www.mouser.co.uk/ProductDetail/EPCOS-TDK/B57862L0103F000?qs=ZcfC38r4PovcwIqh7%252BPHpQ%3D%3D
Y1 = DSC1001CI1-001.0000: DNI; Manufacturer_Name: Microchip; Datasheet Link: https://ww1.microchip.com/downloads/aemDocuments/documents/OTH/ProductDocuments/DataSheets/20005529B.pdf; Height: 0.9mm; Manufacturer_Part_Number: DSC1001CI1-001.0000; Mouser Part Number: 998-1001CI1-001.0000; Mouser Price/Stock: https://www.mouser.co.uk/ProductDetail/Microchip-Technology/DSC1001CI1-001.0000?qs=moDRE%2FDosU0f1JofGoWHJw%3D%3D
C60 = Cap0603: Voltage: DNI
C62-C77 = Cap0402: Voltage: DNI

## Sheet ToF_Bottom.SchDoc
size A4; SheetNumber: 2; SheetTotal: 10
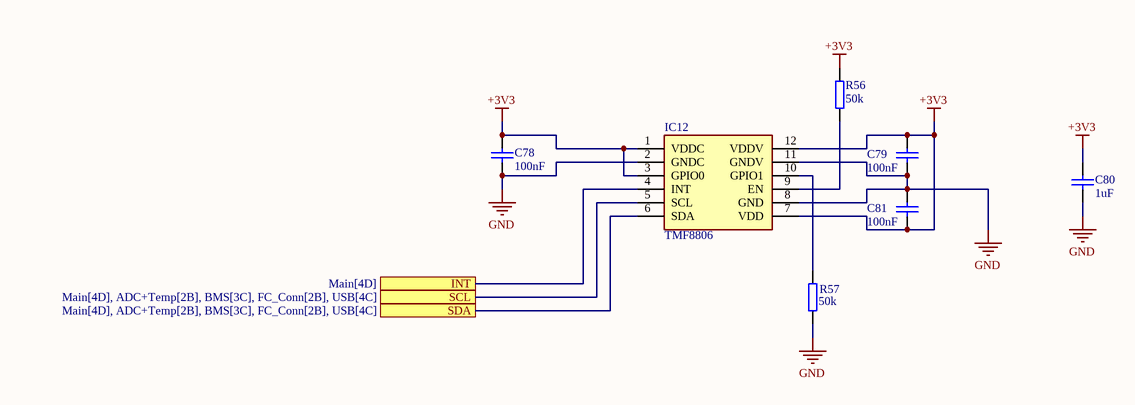
[diagram p5: ToF_Bottom.SchDoc]

### Parts
(Parts that share a designator on the sheet are numbered #1, #2 ... from top to bottom, then left to right.)
C78  value 100nF  [CAP0402]  (hidden comment: Cap0402)
C79  value 100nF  [CAP0402]  (hidden comment: Cap0402)
C80  value 1uF  [CAP0603]  (hidden comment: Cap0603)
C81  value 100nF  [CAP0402]  (hidden comment: Cap0402)
IC12#1  TMF8806  [TMF88051B]
R56  value 50k  [RES0402]  (hidden comment: Res0402)
R57  value 50k  [RES0402]  (hidden comment: Res0402)

### Ports
INT (see Main[4D]), SCL (see Main[4D], ADC+Temp[2B], BMS[3C], FC_Conn[2B], USB[4C]), SDA (see Main[4D], ADC+Temp[2B], BMS[3C], FC_Conn[2B], USB[4C])

### Nets
+3V3: C78.2 C79.2 C80.2 C81.1 IC12#1.1(VDDC) IC12#1.3(GPIO0) IC12#1.7(VDD) IC12#1.12(VDDV) R56.2
GND: C78.1 C79.1 C80.1 C81.2 IC12#1.2(GNDC) IC12#1.8(GND) IC12#1.11(GNDV) R57.1
SCL: IC12#1.5(SCL) ; port SCL
SDA: IC12#1.6(SDA) ; port SDA
TOF_INT: IC12#1.4(INT) ; port INT
NetIC12#1_9: IC12#1.9(EN) R56.1
NetIC12#1_10: IC12#1.10(GPIO1) R57.2

### Library data of the parts
C78 C79 C81 = Cap0402: Voltage: 6V3
C80 = Cap0603: Voltage: 25V
IC12#1 = TMF8805-1B: Integrated Circuit; Manufacturer_Name: ams OSRAM; Datasheet Link: https://ams.com/documents/20143/4372629/TMF8805_DS000692_4-00.pdf; Height: 1.1mm; Manufacturer_Part_Number: TMF8805-1B; Mouser Part Number: 985-TMF8805-1B; Mouser Price/Stock: https://www.mouser.co.uk/ProductDetail/ams-OSRAM/TMF8805-1B?qs=sPbYRqrBIVlwsjHE%2F%252BrL9g%3D%3D

## Sheet FC_Conn.SchDoc
size A3; SheetNumber: 6; SheetTotal: 10
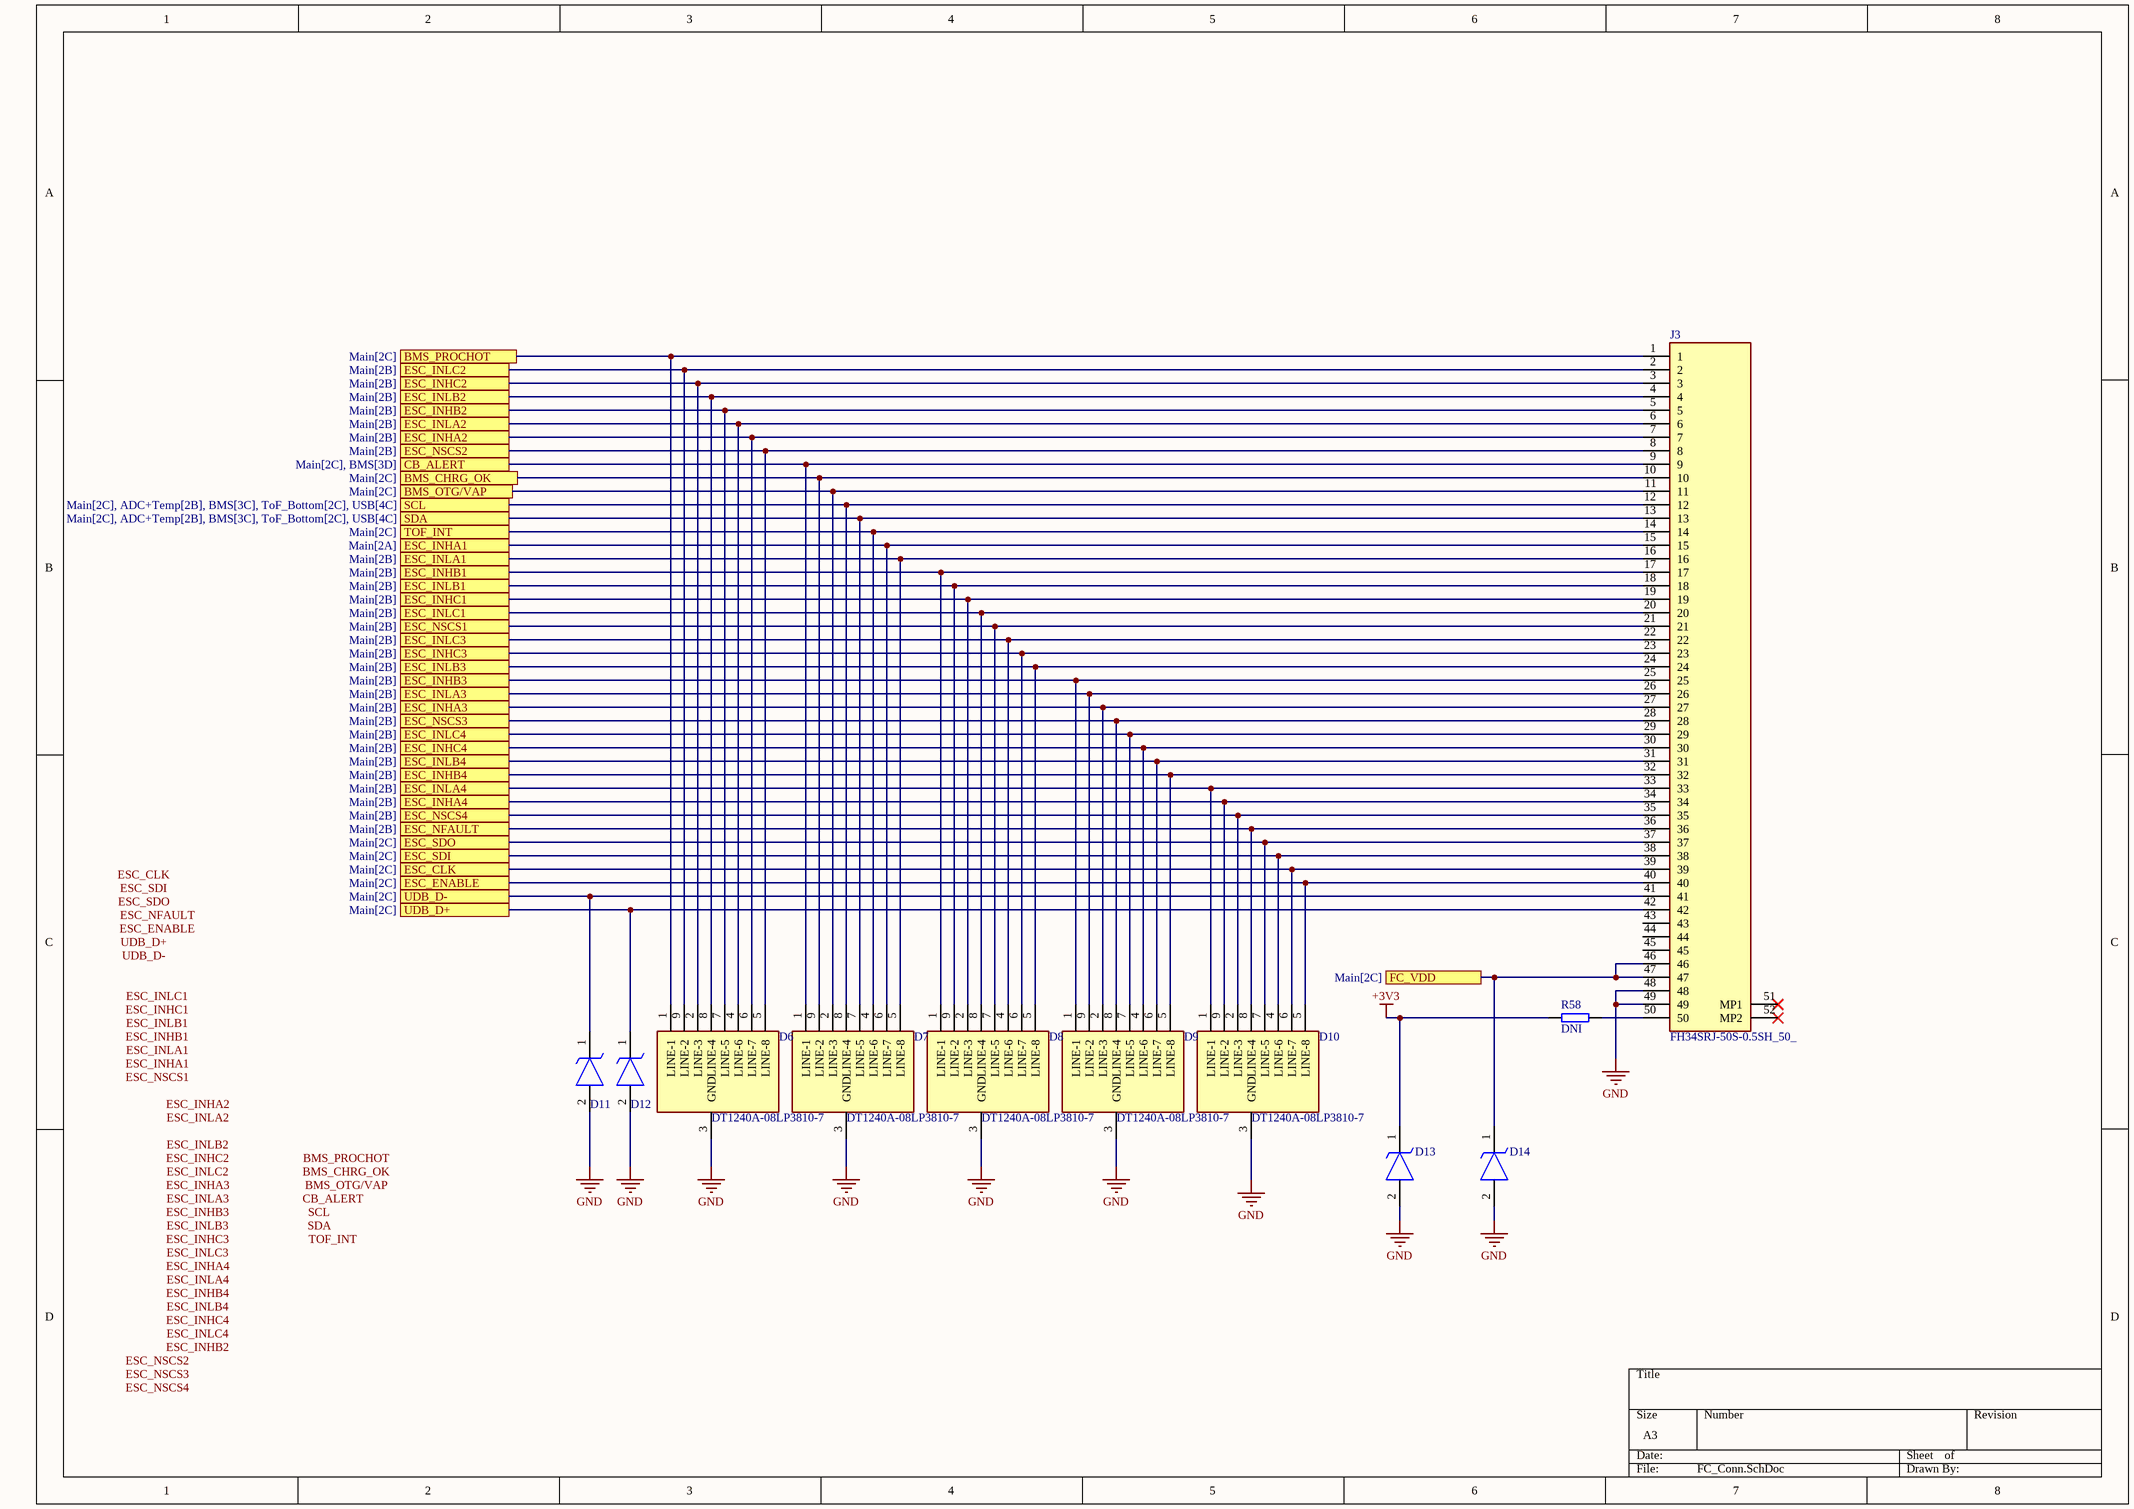
[diagram p6: FC_Conn.SchDoc]

### Parts
D6  DT1240A-08LP3810-7  [DT1240A08LP38107]
D7  DT1240A-08LP3810-7  [DT1240A08LP38107]
D8  DT1240A-08LP3810-7  [DT1240A08LP38107]
D9  DT1240A-08LP3810-7  [DT1240A08LP38107]
D10  DT1240A-08LP3810-7  [DT1240A08LP38107]
D11  D1213A-01LP4-7B  [D1213A01LP47B]  (value not drawn)
D12  D1213A-01LP4-7B  [D1213A01LP47B]  (value not drawn)
D13  DF2S24FS,L3M  [SODFL1006X45N]  (value not drawn)
D14  DF2S24FS,L3M  [SODFL1006X45N]  (value not drawn)
J3  FH34SRJ-50S-0.5SH_50_  [FH34SRJ50S05SH50]
R58  value DNI  [RES0402]  (hidden comment: Res0402)

### Ports
BMS_CHRG_OK (see Main[2C]), BMS_OTG/VAP (see Main[2C]), BMS_PROCHOT (see Main[2C]), CB_ALERT (see Main[2C], BMS[3D]), ESC_CLK (see Main[2C]), ESC_ENABLE (see Main[2C]), ESC_INHA1 (see Main[2A]), ESC_INHA2 (see Main[2B]), ESC_INHA3 (see Main[2B]), ESC_INHA4 (see Main[2B]), ESC_INHB1 (see Main[2B]), ESC_INHB2 (see Main[2B]), ESC_INHB3 (see Main[2B]), ESC_INHB4 (see Main[2B]), ESC_INHC1 (see Main[2B]), ESC_INHC2 (see Main[2B]), ESC_INHC3 (see Main[2B]), ESC_INHC4 (see Main[2B]), ESC_INLA1 (see Main[2B]), ESC_INLA2 (see Main[2B]), ESC_INLA3 (see Main[2B]), ESC_INLA4 (see Main[2B]), ESC_INLB1 (see Main[2B]), ESC_INLB2 (see Main[2B]), ESC_INLB3 (see Main[2B]), ESC_INLB4 (see Main[2B]), ESC_INLC1 (see Main[2B]), ESC_INLC2 (see Main[2B]), ESC_INLC3 (see Main[2B]), ESC_INLC4 (see Main[2B]), ESC_NFAULT (see Main[2B]), ESC_NSCS1 (see Main[2B]), ESC_NSCS2 (see Main[2B]), ESC_NSCS3 (see Main[2B]), ESC_NSCS4 (see Main[2B]), ESC_SDI (see Main[2C]), ESC_SDO (see Main[2C]), FC_VDD (see Main[2C]), SCL (see Main[2C], ADC+Temp[2B], BMS[3C], ToF_Bottom[2C], USB[4C]), SDA (see Main[2C], ADC+Temp[2B], BMS[3C], ToF_Bottom[2C], USB[4C]), TOF_INT (see Main[2C]), UDB_D+ (see Main[2C]), UDB_D- (see Main[2C])

### Nets
+3V3: D13.1(K) R58.2
GND: D6.3(GND) D7.3(GND) D8.3(GND) D9.3(GND) D10.3(GND) D11.2(A) D12.2(A) D13.2(A) D14.2(A) J3.48 J3.49
BMS_CHRG_OK: D7.9(LINE-2) J3.10 ; port BMS_CHRG_OK
BMS_OTG/VAP: D7.2(LINE-3) J3.11 ; port BMS_OTG/VAP
BMS_PROCHOT: D6.1(LINE-1) J3.1 ; port BMS_PROCHOT
CB_ALERT: D7.1(LINE-1) J3.9 ; port CB_ALERT
D_N: D11.1(K) J3.41 ; port UDB_D-
D_P: D12.1(K) J3.42 ; port UDB_D+
ESC_CLK: D10.6(LINE-7) J3.39 ; port ESC_CLK
ESC_ENABLE: D10.5(LINE-8) J3.40 ; port ESC_ENABLE
ESC_INHA_A: D7.6(LINE-7) J3.15 ; port ESC_INHA1
ESC_INHA_B: D6.6(LINE-7) J3.7 ; port ESC_INHA2
ESC_INHA_C: D9.2(LINE-3) J3.27 ; port ESC_INHA3
ESC_INHA_D: D10.9(LINE-2) J3.34 ; port ESC_INHA4
ESC_INHB_A: D8.1(LINE-1) J3.17 ; port ESC_INHB1
ESC_INHB_B: D6.7(LINE-5) J3.5 ; port ESC_INHB2
ESC_INHB_C: D9.1(LINE-1) J3.25 ; port ESC_INHB3
ESC_INHB_D: D9.5(LINE-8) J3.32 ; port ESC_INHB4
ESC_INHC_A: D8.2(LINE-3) J3.19 ; port ESC_INHC1
ESC_INHC_B: D6.2(LINE-3) J3.3 ; port ESC_INHC2
ESC_INHC_C: D8.6(LINE-7) J3.23 ; port ESC_INHC3
ESC_INHC_D: D9.4(LINE-6) J3.30 ; port ESC_INHC4
ESC_INLA_A: D7.5(LINE-8) J3.16 ; port ESC_INLA1
ESC_INLA_B: D6.4(LINE-6) J3.6 ; port ESC_INLA2
ESC_INLA_C: D9.9(LINE-2) J3.26 ; port ESC_INLA3
ESC_INLA_D: D10.1(LINE-1) J3.33 ; port ESC_INLA4
ESC_INLB_A: D8.9(LINE-2) J3.18 ; port ESC_INLB1
ESC_INLB_B: D6.8(LINE-4) J3.4 ; port ESC_INLB2
ESC_INLB_C: D8.5(LINE-8) J3.24 ; port ESC_INLB3
ESC_INLB_D: D9.6(LINE-7) J3.31 ; port ESC_INLB4
ESC_INLC_A: D8.8(LINE-4) J3.20 ; port ESC_INLC1
ESC_INLC_B: D6.9(LINE-2) J3.2 ; port ESC_INLC2
ESC_INLC_C: D8.4(LINE-6) J3.22 ; port ESC_INLC3
ESC_INLC_D: D9.7(LINE-5) J3.29 ; port ESC_INLC4
ESC_NFAULT: D10.8(LINE-4) J3.36 ; port ESC_NFAULT
ESC_NSCS_A: D8.7(LINE-5) J3.21 ; port ESC_NSCS1
ESC_NSCS_B: D6.5(LINE-8) J3.8 ; port ESC_NSCS2
ESC_NSCS_C: D9.8(LINE-4) J3.28 ; port ESC_NSCS3
ESC_NSCS_D: D10.2(LINE-3) J3.35 ; port ESC_NSCS4
ESC_SDI: D10.4(LINE-6) J3.38 ; port ESC_SDI
ESC_SDO: D10.7(LINE-5) J3.37 ; port ESC_SDO
SCL: D7.8(LINE-4) J3.12 ; port SCL
SDA: D7.7(LINE-5) J3.13 ; port SDA
TOF_INT: D7.4(LINE-6) J3.14 ; port TOF_INT
VSYS: D14.1(K) J3.46 J3.47 ; port FC_VDD
NetJ3_50: J3.50 R58.1

Not connected (* = marked no-connect by the designer): J3 43 44 45 51(MP1)* 52(MP2)*

### Notes on the sheet
- Each ESC can output 30mA, PB schould be able to sustain itself
- Labels drawn without touching a wire or pin: BMS_CHRG_OK, BMS_OTG/VAP, BMS_PROCHOT, CB_ALERT, ESC_CLK, ESC_ENABLE, ESC_INHA1, ESC_INHA2, ESC_INHA3, ESC_INHA4, ESC_INHB1, ESC_INHB2, ESC_INHB3, ESC_INHB4, ESC_INHC1, ESC_INHC2, ESC_INHC3, ESC_INHC4, ESC_INLA1, ESC_INLA2, ESC_INLA3, ESC_INLA4, ESC_INLB1, ESC_INLB2, ESC_INLB3, ESC_INLB4, ESC_INLC1, ESC_INLC2, ESC_INLC3, ESC_INLC4, ESC_NFAULT, ESC_NSCS1, ESC_NSCS2, ESC_NSCS3, ESC_NSCS4, ESC_SDI, ESC_SDO, SCL, SDA, TOF_INT, UDB_D+, UDB_D-

### Library data of the parts
D6-D10 = DT1240A-08LP3810-7: TVS Diode (Uni-directional); Manufacturer_Name: Diodes Incorporated; Datasheet Link: https://www.diodes.com//assets/Datasheets/DT1240A-08LP3810.pdf; Height: 0.55mm; Manufacturer_Part_Number: DT1240A-08LP3810-7; Mouser Part Number: 621-DT1240A08LP38107; Mouser Price/Stock: https://www.mouser.co.uk/ProductDetail/Diodes-Incorporated/DT1240A-08LP3810-7?qs=W0yvOO0ixfFwCalJyqXN4A%3D%3D; Arrow Part Number: DT1240A-08LP3810-7; Arrow Price/Stock: null?region=nac
D11 D12 = D1213A-01LP4-7B: as D3 on sheet USB; Datasheet Link: https://www.diodes.com/assets/Datasheets/D1213A-01LP4.pdf; Height: 0.4mm; Manufacturer_Part_Number: D1213A-01LP4-7B; Mouser Part Number: 621-D1213A-01LP4-7B; Mouser Price/Stock: https://www.mouser.co.uk/ProductDetail/Diodes-Incorporated/D1213A-01LP4-7B?qs=gfe7vQ8txpVKfG5NOSOvfA%3D%3D; Arrow Part Number: D1213A-01LP4-7B; Arrow Price/Stock: https://www.arrow.com/en/products/d1213a-01lp4-7b/diodes-incorporated?region=europe
D13 D14 = DF2S24FS,L3M: as D5 on sheet USB; Datasheet Link: https://www.mouser.com/datasheet/2/408/DF2S24FS_datasheet_en_20140718-708374.pdf; Height: 0.45mm; Manufacturer_Part_Number: DF2S24FS,L3M; Mouser Part Number: 757-DF2S24FSL3M; Mouser Price/Stock: https://www.mouser.co.uk/ProductDetail/Toshiba/DF2S24FSL3M?qs=lhkzy8lC%252BSvG2umxl0FuEw%3D%3D; Arrow Part Number: DF2S24FS,L3M; Arrow Price/Stock: https://www.arrow.com/en/products/df2s24fsl3m/toshiba?region=nac
J3 = FH34SRJ-50S-0.5SH_50_: Connector; Manufacturer_Name: Hirose; Manufacturer_Part_Number: FH34SRJ-50S-0.5SH(50); Datasheet Link: https://www.hirose.com/en/product/document?clcode=CL0580-1266-2-50&productname=FH34SRJ-50S-0.5SH(50)&series=FH34SRJ&documenttype=2DDrawing&lang=en&documentid=0001483059; Height: 1.75mm; Mouser Part Number: 798-FH34SRJ50S05SH50; Mouser Price/Stock: https://www.mouser.co.uk/ProductDetail/Hirose-Connector/FH34SRJ-50S-0.5SH50?qs=vcbW%252B4%252BSTIrLLD%2F8H%2F%252B%2Fhg%3D%3D; System: Connector

## Sheet ESC_A.SchDoc
size A3; SheetNumber: 7; SheetTotal: 10
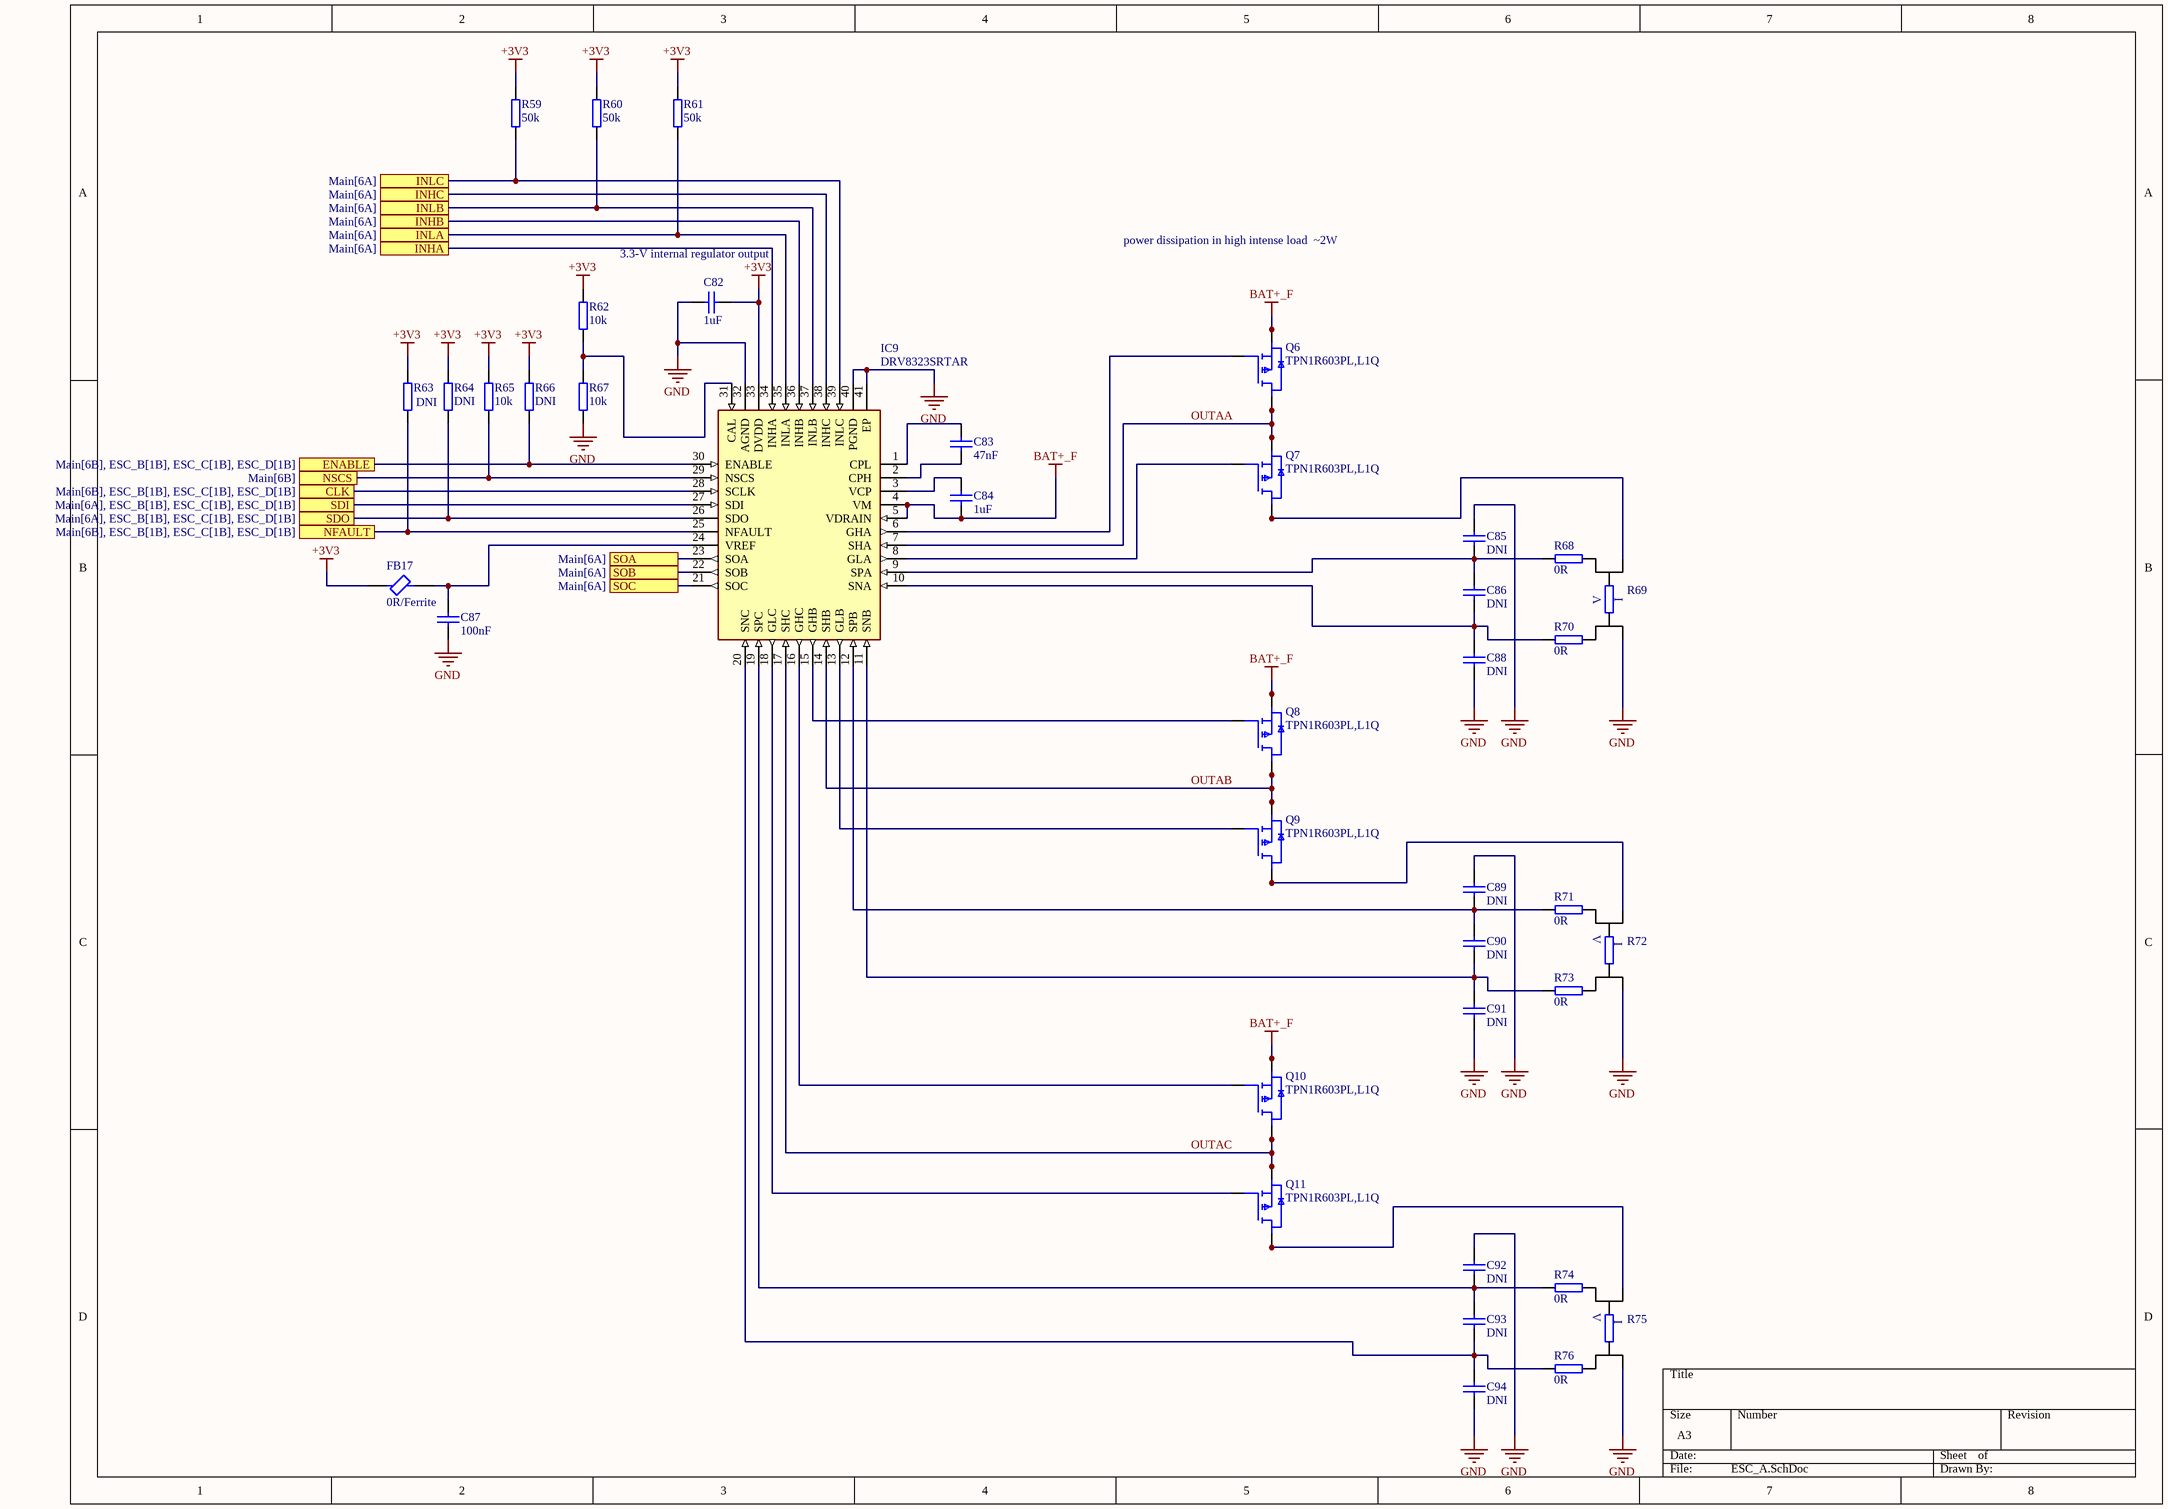
[diagram p7: ESC_A.SchDoc]

### Parts
C82  value 1uF  [CAP0402]  (hidden comment: Cap0402)
C83  value 47nF  [CAP0603]  (hidden comment: CapSMD0603)
C84  value 1uF  [CAP0603]  (hidden comment: CapSMD0603)
C85  value DNI  [CAP0402]  (hidden comment: Cap0402)
C86  value DNI  [CAP0402]  (hidden comment: Cap0402)
C87  value 100nF  [CAP0402]  (hidden comment: Cap0402)
C88  value DNI  [CAP0402]  (hidden comment: Cap0402)
C89  value DNI  [CAP0402]  (hidden comment: Cap0402)
C90  value DNI  [CAP0402]  (hidden comment: Cap0402)
C91  value DNI  [CAP0402]  (hidden comment: Cap0402)
C92  value DNI  [CAP0402]  (hidden comment: Cap0402)
C93  value DNI  [CAP0402]  (hidden comment: Cap0402)
C94  value DNI  [CAP0402]  (hidden comment: Cap0402)
FB17  0R/Ferrite  [NFZ15SG152SN10B]
IC9  DRV8323SRTAR  [QFN50P600X600X80-41N-D]
Q6  TPN1R603PL,L1Q  [TPN1R603PLL1Q]
Q7  TPN1R603PL,L1Q  [TPN1R603PLL1Q]
Q8  TPN1R603PL,L1Q  [TPN1R603PLL1Q]
Q9  TPN1R603PL,L1Q  [TPN1R603PLL1Q]
Q10  TPN1R603PL,L1Q  [TPN1R603PLL1Q]
Q11  TPN1R603PL,L1Q  [TPN1R603PLL1Q]
R59  value 50k  [RES0402]  (hidden comment: Res0402)
R60  value 50k  [RES0402]  (hidden comment: Res0402)
R61  value 50k  [RES0402]  (hidden comment: Res0402)
R62  value 10k  [RES0402]  (hidden comment: Res0402)
R63  value DNI  [RES0402]  (hidden comment: Res0402)
R64  value DNI  [RES0402]  (hidden comment: Res0402)
R65  value 10k  [RES0402]  (hidden comment: Res0402)
R66  value DNI  [RES0402]  (hidden comment: Res0402)
R67  value 10k  [RES0402]  (hidden comment: Res0402)
R68  value 0R  [RES0402]  (hidden comment: Res0402)
R69  WSK12161L000FEA  [WSK12161L000FEA]  (value not drawn)
R70  value 0R  [RES0402]  (hidden comment: Res0402)
R71  value 0R  [RES0402]  (hidden comment: Res0402)
R72  WSK12161L000FEA  [WSK12161L000FEA]  (value not drawn)
R73  value 0R  [RES0402]  (hidden comment: Res0402)
R74  value 0R  [RES0402]  (hidden comment: Res0402)
R75  WSK12161L000FEA  [WSK12161L000FEA]  (value not drawn)
R76  value 0R  [RES0402]  (hidden comment: Res0402)

### Ports
CLK (see Main[6B], ESC_B[1B], ESC_C[1B], ESC_D[1B]), ENABLE (see Main[6B], ESC_B[1B], ESC_C[1B], ESC_D[1B]), INHA (see Main[6A]), INHB (see Main[6A]), INHC (see Main[6A]), INLA (see Main[6A]), INLB (see Main[6A]), INLC (see Main[6A]), NFAULT (see Main[6B], ESC_B[1B], ESC_C[1B], ESC_D[1B]), NSCS (see Main[6B]), SDI (see Main[6A], ESC_B[1B], ESC_C[1B], ESC_D[1B]), SDO (see Main[6A], ESC_B[1B], ESC_C[1B], ESC_D[1B]), SOA (see Main[6A]), SOB (see Main[6A]), SOC (see Main[6A])

### Nets
+3V3: C82.2 FB17.1 IC9.33(DVDD) R59.2 R60.2 R61.2 R62.2 R63.2 R64.2 R65.2 R66.2
BAT+_F: C84.1 IC9.4(VM) IC9.5(VDRAIN) Q6.1(S_1) Q6.2(S_2) Q6.3(S_3) Q8.1(S_1) Q8.2(S_2) Q8.3(S_3) Q10.1(S_1) Q10.2(S_2) Q10.3(S_3)
GND: C82.1 C85.1 C87.1 C88.2 C89.1 C91.2 C92.1 C94.2 IC9.32(AGND) IC9.40(PGND) IC9.41(EP) R67.1 R69.1 R72.4 R75.4
ESC_CLK: IC9.28(SCLK) ; port CLK
ESC_ENABLE: IC9.30(ENABLE) R66.1 ; port ENABLE
ESC_INHA_A: IC9.34(INHA) ; port INHA
ESC_INHB_A: IC9.36(INHB) ; port INHB
ESC_INHC_A: IC9.38(INHC) ; port INHC
ESC_INLA_A: IC9.35(INLA) R61.1 ; port INLA
ESC_INLB_A: IC9.37(INLB) R60.1 ; port INLB
ESC_INLC_A: IC9.39(INLC) R59.1 ; port INLC
ESC_NFAULT: IC9.25(NFAULT) R63.1 ; port NFAULT
ESC_NSCS_A: IC9.29(NSCS) R65.1 ; port NSCS
ESC_SDI: IC9.27(SDI) ; port SDI
ESC_SDO: IC9.26(SDO) R64.1 ; port SDO
ESC_SOA_A: IC9.23(SOA) ; port SOA
ESC_SOB_A: IC9.22(SOB) ; port SOB
ESC_SOC_A: IC9.21(SOC) ; port SOC
OUTAA: IC9.7(SHA) Q6.5(D_1) Q6.6(D_2) Q6.7(D_3) Q6.8(D_4) Q6.9(D_4) Q7.1(S_1) Q7.2(S_2) Q7.3(S_3)
OUTAB: IC9.14(SHB) Q8.5(D_1) Q8.6(D_2) Q8.7(D_3) Q8.8(D_4) Q8.9(D_4) Q9.1(S_1) Q9.2(S_2) Q9.3(S_3)
OUTAC: IC9.17(SHC) Q10.5(D_1) Q10.6(D_2) Q10.7(D_3) Q10.8(D_4) Q10.9(D_4) Q11.1(S_1) Q11.2(S_2) Q11.3(S_3)
NetC83_1: C83.1 IC9.2(CPH)
NetC83_2: C83.2 IC9.1(CPL)
NetC84_2: C84.2 IC9.3(VCP)
NetC85_2: C85.2 C86.1 IC9.9(SPA) R68.1
NetC86_2: C86.2 C88.1 IC9.10(SNA) R70.1
NetC87_2: C87.2 FB17.2 IC9.24(VREF)
NetC89_2: C89.2 C90.1 IC9.12(SPB) R71.1
NetC90_2: C90.2 C91.1 IC9.11(SNB) R73.1
NetC92_2: C92.2 C93.1 IC9.19(SPC) R74.1
NetC93_2: C93.2 C94.1 IC9.20(SNC) R76.1
NetIC9_6: IC9.6(GHA) Q6.4(G)
NetIC9_8: IC9.8(GLA) Q7.4(G)
NetIC9_13: IC9.13(GLB) Q9.4(G)
NetIC9_15: IC9.15(GHB) Q8.4(G)
NetIC9_16: IC9.16(GHC) Q10.4(G)
NetIC9_18: IC9.18(GLC) Q11.4(G)
NetIC9_31: IC9.31(CAL) R62.1 R67.2
NetQ7_5: Q7.5(D_1) Q7.6(D_2) Q7.7(D_3) Q7.8(D_4) Q7.9(D_4) R69.4
NetQ9_5: Q9.5(D_1) Q9.6(D_2) Q9.7(D_3) Q9.8(D_4) Q9.9(D_4) R72.1
NetQ11_5: Q11.5(D_1) Q11.6(D_2) Q11.7(D_3) Q11.8(D_4) Q11.9(D_4) R75.1
NetR68_2: R68.2 R69.3
NetR69_2: R69.2 R70.2
NetR71_2: R71.2 R72.2
NetR72_3: R72.3 R73.2
NetR74_2: R74.2 R75.2
NetR75_3: R75.3 R76.2

### Notes on the sheet
- power dissipation in high intense load  ~2W
- 3.3-V internal regulator output
- (near IC9) Separate grounds?
- (in symbol WSK1216L5000FEA) I; V

### Library data of the parts
C82 = Cap0402: Voltage: val
C83 C84 = CapSMD0603: 50V; Published: 8-Jun-2000; LatestRevisionDate: 29-May-2009; LatestRevisionNote: IPC-7351 Footprint Added.; PackageReference: C1206; Publisher: Altium Limited; PackageDescription: Chip Capacitor
C87 = Cap0402: Voltage: 6V3
FB17 = BLM15PE471SH1D: as FB1 on sheet ADC+Temp; Datasheet Link: https://www.murata.com/en-global/products/productdetail.aspx?cate=luNoiseSupprFilteChipFerriBead&partno=BLM15PE471SH1%23; Height: 0.55mm; Manufacturer_Part_Number: BLM15PE471SH1D; Mouser Part Number: 81-BLM15PE471SH1D; Mouser Price/Stock: https://www.mouser.co.uk/ProductDetail/Murata-Electronics/BLM15PE471SH1D?qs=DRkmTr78QATAY5qAVx1hGA%3D%3D
IC9 = DRV8323SRTAR: Integrated Circuit; Manufacturer_Name: Texas Instruments; Datasheet Link: http://www.ti.com/lit/ds/symlink/drv8323.pdf; Height: 0.8mm; Manufacturer_Part_Number: DRV8323SRTAR; Mouser Part Number: 595-DRV8323SRTAR; Mouser Price/Stock: https://www.mouser.co.uk/ProductDetail/Texas-Instruments/DRV8323SRTAR?qs=u4fy%2FsgLU9P2gpPTX6mffg%3D%3D; Arrow Part Number: DRV8323SRTAR; Arrow Price/Stock: https://www.arrow.com/en/products/drv8323srtar/texas-instruments?utm_currency=USD&region=nac
Q6-Q11 = TPN1R603PL,L1Q: MOSFET (N-Channel); Manufacturer_Name: Toshiba; Datasheet Link: https://toshiba.semicon-storage.com/ap-en/semiconductor/product/mosfets/12v-300v-mosfets/detail.TPN1R603PL.html; Height: 0.9mm; Manufacturer_Part_Number: TPN1R603PL,L1Q; Mouser Part Number: 757-TPN1R603PLL1Q; Mouser Price/Stock: https://www.mouser.co.uk/ProductDetail/Toshiba/TPN1R603PLL1Q?qs=bUPhaerQQeGYpGlYi%252BLguw%3D%3D; Arrow Part Number: TPN1R603PL,L1Q; Arrow Price/Stock: https://www.arrow.com/en/products/tpn1r603pll1q/toshiba?utm_currency=USD&region=nac
R69 R72 R75 = WSK1216L5000FEA: Resistor; Manufacturer_Name: Vishay; Datasheet Link: http://www.vishay.com/docs/30189/wsk1216.pdf; Height: 1.9mm; Manufacturer_Part_Number: WSK1216L5000FEA; Mouser Part Number: 71-WSK1216L5000FEA; Mouser Price/Stock: https://www.mouser.co.uk/ProductDetail/Vishay-Dale/WSK1216L5000FEA?qs=OlC7AqGiEDlM2wGD42LFoQ%3D%3D; Arrow Part Number: WSK1216L5000FEA; Arrow Price/Stock: https://www.arrow.com/en/products/wsk1216l5000fea/vishay?region=nac
C85 C86 C88-C94 = Cap0402: Voltage: DNI